# Altium project Tigershark 3D rev2 PreProduction Thermistors Version.PrjPcb (part 1 of 2)
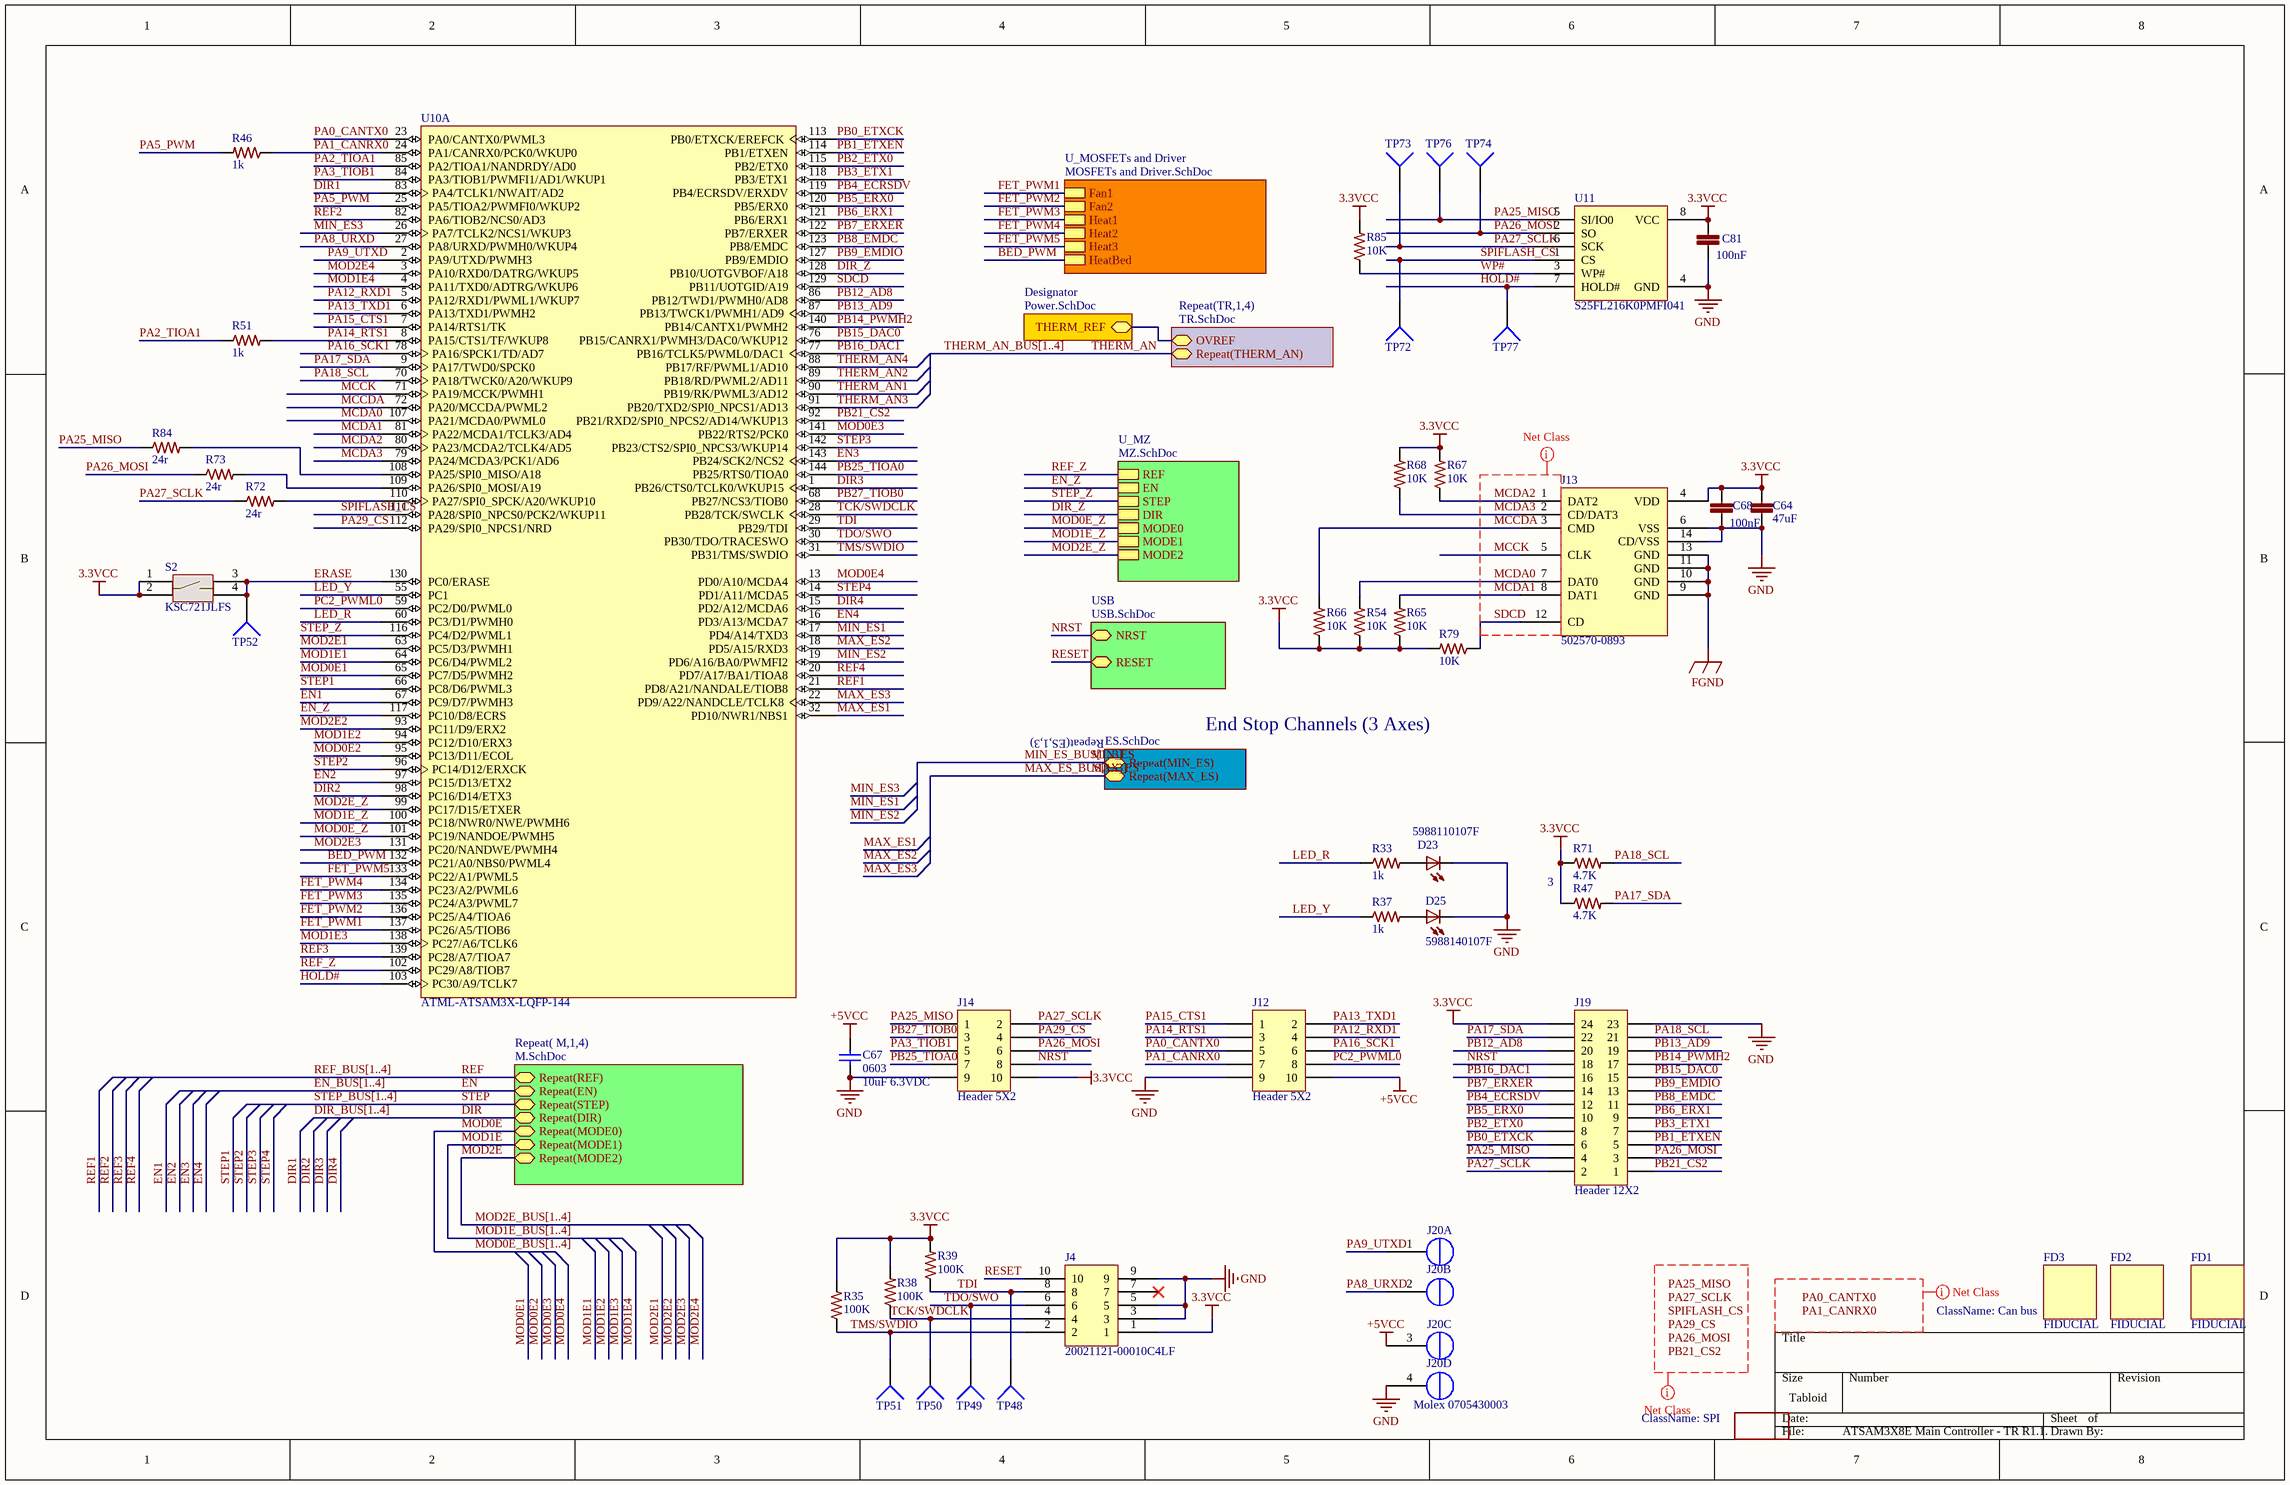
[diagram p0: ATSAM3X8E Main Controller - TR R1.1.SchDoc]
8 sheets, 511 parts. Net scope: hierarchical (ports join the sheet entries above them; power ports are global).
Board file: Tigershark 3D R2.4 - TR.PcbDoc
Sheets:
  ATSAM3X8E Main Controller - TR R1.1.SchDoc
    TR1 = TR.SchDoc
    TR2 = TR.SchDoc
    TR3 = TR.SchDoc
    TR4 = TR.SchDoc
    Designator = Power.SchDoc
    ES1 = ES.SchDoc
    ES2 = ES.SchDoc
    ES3 = ES.SchDoc
    M1 = M.SchDoc
    M2 = M.SchDoc
    M3 = M.SchDoc
    M4 = M.SchDoc
    U_MOSFETs and Driver = MOSFETs and Driver.SchDoc
    U_MZ = MZ.SchDoc
    USB = USB.SchDoc

## Sheet ATSAM3X8E Main Controller - TR R1.1.SchDoc
size Tabloid; DocumentNumber: 1; SheetNumber: 1; SheetTotal: 8

### Parts
C64  47uF  [C0805]
C67  0603  value 10uF 6.3VDC  [C0603]
C68  100nF  [C0402]
C81  100nF  [C0402]
D23  5988110107F  [LED2012120]
D25  5988140107F  [LED2012120]
FD1  FIDUCIAL  [FIDUCIAL-1X2]
FD2  FIDUCIAL  [FIDUCIAL-1X2]
FD3  FIDUCIAL  [FIDUCIAL-1X2]
J4  20021121-00010C4LF  [FTSH-105-XX-X-DV]
J12  Header 5X2  [HDR2X5]
J13  502570-0893  [502570-0893 - Molex SD]
J14  Header 5X2  [HDR2X5]
J19  Header 12X2  [HDR2X12]
J20  Molex 0705430003  [4POL254]  (parts A,B,C,D of 4)
LOGO1  OSHW_LOGO_8MILX0150-NT  [OSHW_8X150_NOTEXT]  (value not drawn)
R33  1k  [R0402]
R35  100K  [R0402]
R37  1k  [R0402]
R38  100K  [R0402]
R39  100K  [R0402]
R46  1k  [R0402]
R47  4.7K  [R0603]
R51  1k  [R0402]
R54  10K  [R0402]
R65  10K  [R0402]
R66  10K  [R0402]
R67  10K  [R0402]
R68  10K  [R0402]
R71  4.7K  [R0603]
R72  24r  [R0402]
R73  24r  [R0402]
R79  10K  [R0402]
R84  24r  [R0402]
R85  10K  [R0402]
S2  KSC721JLFS  [KSC721JLFS]
TP48  TP4  [TP-2]  (value not drawn)
TP49  TP4  [TP-2]  (value not drawn)
TP50  TP4  [TP-2]  (value not drawn)
TP51  TP4  [TP-2]  (value not drawn)
TP52  TP4  [TP-2]  (value not drawn)
TP72  TP4  [TP-2]  (value not drawn)
TP73  TP4  [TP-2]  (value not drawn)
TP74  TP4  [TP-2]  (value not drawn)
TP76  TP4  [TP-2]  (value not drawn)
TP77  TP4  [TP-2]  (value not drawn)
U10  ATML-ATSAM3X-LQFP-144  [LQFP144_N]  (part A of 3)
U11  S25FL216K0PMFI041  [S25FL216K0PMFI041]

### Sub-sheets
Designator = Power.SchDoc: THERM_REF
Repeat( M,1,4) = M.SchDoc: Repeat(REF), Repeat(EN), Repeat(STEP), Repeat(DIR), Repeat(MODE0), Repeat(MODE1), Repeat(MODE2)
Repeat(ES,1,3) = ES.SchDoc: Repeat(MAX_ES), Repeat(MIN_ES)
Repeat(TR,1,4) = TR.SchDoc: OVREF, Repeat(THERM_AN)
U_MOSFETs and Driver = MOSFETs and Driver.SchDoc: Fan1, Fan2, Heat1, Heat2, Heat3, HeatBed
U_MZ = MZ.SchDoc: REF, EN, STEP, DIR, MODE0, MODE1, MODE2
USB = USB.SchDoc: NRST, RESET

### Nets
3.3VCC: C64.1 C68.1 C81.1 J4.1 J13.4(VDD) J14.10 J19.24 R35.2 R38.2 R39.2 R47.1 R54.1 R65.1 R66.1 R67.2 R68.2 R71.1 R79.2 R85.2 S2.1 S2.2 U11.8(VCC)
+5VCC: C67.2 J12.10 J20.3(OUT1A)
FGND: J13.9(GND) J13.10(GND) J13.11(GND) J13.13(GND)
GND: C64.2 C67.1 C68.2 C81.2 D23.C D25.C J4.3 J4.5 J4.9 J12.9 J13.6(VSS) J13.14(CD/VSS) J14.9 J19.23 J20.4(OUT1B) U11.4(GND)
BED_PWM: U10.132(PC21/A0/NBS0/PWML4) ; sheet U_MOSFETs and Driver/HeatBed
DIR: sheet Repeat( M,1,4)/Repeat(DIR)
DIR1: U10.83(PA4/TCLK1/NWAIT/AD2)
DIR2: U10.98(PC16/D14/ETX3)
DIR3: U10.1(PB26/CTS0/TCLK0/WKUP15)
DIR4: U10.15(PD2/A12/MCDA6)
DIR_Z: U10.128(PB10/UOTGVBOF/A18) ; sheet U_MZ/DIR
EN: sheet Repeat( M,1,4)/Repeat(EN)
EN1: U10.67(PC9/D7/PWMH3)
EN2: U10.97(PC15/D13/ETX2)
EN3: U10.143(PB24/SCK2/NCS2)
EN4: U10.16(PD3/A13/MCDA7)
EN_Z: U10.117(PC10/D8/ECRS) ; sheet U_MZ/EN
ERASE: S2.3 S2.4 TP52.1 U10.130(PC0/ERASE)
FET_PWM1: U10.137(PC26/A5/TIOB6) ; sheet U_MOSFETs and Driver/Fan1
FET_PWM2: U10.136(PC25/A4/TIOA6) ; sheet U_MOSFETs and Driver/Fan2
FET_PWM3: U10.135(PC24/A3/PWML7) ; sheet U_MOSFETs and Driver/Heat1
FET_PWM4: U10.134(PC23/A2/PWML6) ; sheet U_MOSFETs and Driver/Heat2
FET_PWM5: U10.133(PC22/A1/PWML5) ; sheet U_MOSFETs and Driver/Heat3
HOLD#: TP77.1 U10.103(PC30/A9/TCLK7) U11.7(HOLD#)
LED_R: R33.1 U10.60(PC3/D1/PWMH0)
LED_Y: R37.1 U10.55(PC1)
MAX_ES: sheet Repeat(ES,1,3)/Repeat(MAX_ES)
MAX_ES1: U10.32(PD10/NWR1/NBS1)
MAX_ES2: U10.18(PD5/A15/RXD3)
MAX_ES3: U10.22(PD9/A22/NANDCLE/TCLK8)
MCCDA: J13.3(CMD) R66.2 U10.72(PA20/MCCDA/PWML2)
MCCK: J13.5(CLK) U10.71(PA19/MCCK/PWMH1)
MCDA0: J13.7(DAT0) R54.2 U10.107(PA21/MCDA0/PWML0)
MCDA1: J13.8(DAT1) R65.2 U10.81(PA22/MCDA1/TCLK3/AD4)
MCDA2: J13.1(DAT2) R67.1 U10.80(PA23/MCDA2/TCLK4/AD5)
MCDA3: J13.2(CD/DAT3) R68.1 U10.79(PA24/MCDA3/PCK1/AD6)
MIN_ES: sheet Repeat(ES,1,3)/Repeat(MIN_ES)
MIN_ES1: U10.17(PD4/A14/TXD3)
MIN_ES2: U10.19(PD6/A16/BA0/PWMFI2)
MIN_ES3: U10.26(PA7/TCLK2/NCS1/WKUP3)
MOD0E: sheet Repeat( M,1,4)/Repeat(MODE0)
MOD0E1: U10.65(PC7/D5/PWMH2)
MOD0E2: U10.95(PC13/D11/ECOL)
MOD0E3: U10.141(PB22/RTS2/PCK0)
MOD0E4: U10.13(PD0/A10/MCDA4)
MOD0E_Z: U10.101(PC19/NANDOE/PWMH5) ; sheet U_MZ/MODE0
MOD1E: sheet Repeat( M,1,4)/Repeat(MODE1)
MOD1E1: U10.64(PC6/D4/PWML2)
MOD1E2: U10.94(PC12/D10/ERX3)
MOD1E3: U10.138(PC27/A6/TCLK6)
MOD1E4: U10.4(PA11/TXD0/ADTRG/WKUP6)
MOD1E_Z: U10.100(PC18/NWR0/NWE/PWMH6) ; sheet U_MZ/MODE1
MOD2E: sheet Repeat( M,1,4)/Repeat(MODE2)
MOD2E1: U10.63(PC5/D3/PWMH1)
MOD2E2: U10.93(PC11/D9/ERX2)
MOD2E3: U10.131(PC20/NANDWE/PWMH4)
MOD2E4: U10.3(PA10/RXD0/DATRG/WKUP5)
MOD2E_Z: U10.99(PC17/D15/ETXER) ; sheet U_MZ/MODE2
NRST: J14.8 J19.18 ; sheet USB/NRST
PA0_CANTX0: J12.5 U10.23(PA0/CANTX0/PWML3)
PA1_CANRX0: J12.7 R46.1 U10.24(PA1/CANRX0/PCK0/WKUP0)
PA2_TIOA1: R51.1 U10.85(PA2/TIOA1/NANDRDY/AD0)
PA3_TIOB1: J14.5 U10.84(PA3/TIOB1/PWMFI1/AD1/WKUP1)
PA5_PWM: R46.2 U10.25(PA5/TIOA2/PWMFI0/WKUP2)
PA8_URXD: J20.2(OUT2A) U10.27(PA8/URXD/PWMH0/WKUP4)
PA9_UTXD: J20.1(OUT2B) U10.2(PA9/UTXD/PWMH3)
PA12_RXD1: J12.4 U10.5(PA12/RXD1/PWML1/WKUP7)
PA13_TXD1: J12.2 U10.6(PA13/TXD1/PWMH2)
PA14_RTS1: J12.3 R51.2 U10.8(PA15/CTS1/TF/WKUP8)
PA15_CTS1: J12.1 U10.7(PA14/RTS1/TK)
PA16_SCK1: J12.6 U10.78(PA16/SPCK1/TD/AD7)
PA17_SDA: J19.22 R47.2 U10.9(PA17/TWD0/SPCK0)
PA18_SCL: J19.21 R71.2 U10.70(PA18/TWCK0/A20/WKUP9)
PA25_MISO: J14.1 J19.4 R84.1 TP76.1 U11.5(SI/IO0)
PA26_MOSI: J14.6 J19.3 R73.1 TP74.1 U11.2(SO)
PA27_SCLK: J14.2 J19.2 R72.1 TP73.1 U11.6(SCK)
PA29_CS: J14.4 U10.112(PA29/SPI0_NPCS1/NRD)
PB0_ETXCK: J19.6 U10.113(PB0/ETXCK/EREFCK)
PB1_ETXEN: J19.5 U10.114(PB1/ETXEN)
PB2_ETX0: J19.8 U10.115(PB2/ETX0)
PB3_ETX1: J19.7 U10.118(PB3/ETX1)
PB4_ECRSDV: J19.12 U10.119(PB4/ECRSDV/ERXDV)
PB5_ERX0: J19.10 U10.120(PB5/ERX0)
PB6_ERX1: J19.9 U10.121(PB6/ERX1)
PB7_ERXER: J19.14 U10.122(PB7/ERXER)
PB8_EMDC: J19.11 U10.123(PB8/EMDC)
PB9_EMDIO: J19.13 U10.127(PB9/EMDIO)
PB12_AD8: J19.20 U10.86(PB12/TWD1/PWMH0/AD8)
PB13_AD9: J19.19 U10.87(PB13/TWCK1/PWMH1/AD9)
PB14_PWMH2: J19.17 U10.140(PB14/CANTX1/PWMH2)
PB15_DAC0: J19.15 U10.76(PB15/CANRX1/PWMH3/DAC0/WKUP12)
PB16_DAC1: J19.16 U10.77(PB16/TCLK5/PWML0/DAC1)
PB21_CS2: J19.1 U10.92(PB21/RXD2/SPI0_NPCS2/AD14/WKUP13)
PB25_TIOA0: J14.7 U10.144(PB25/RTS0/TIOA0)
PB27_TIOB0: J14.3 U10.68(PB27/NCS3/TIOB0)
PC2_PWML0: J12.8 U10.59(PC2/D0/PWML0)
REF: sheet Repeat( M,1,4)/Repeat(REF)
REF1: U10.21(PD8/A21/NANDALE/TIOB8)
REF2: U10.82(PA6/TIOB2/NCS0/AD3)
REF3: U10.139(PC28/A7/TIOA7)
REF4: U10.20(PD7/A17/BA1/TIOA8)
REF_Z: U10.102(PC29/A8/TIOB7) ; sheet U_MZ/REF
RESET: J4.10 ; sheet USB/RESET
SDCD: J13.12(CD) R79.1 U10.129(PB11/UOTGID/A19)
SPIFLASH_CS: TP72.1 U10.111(PA28/SPI0_NPCS0/PCK2/WKUP11) U11.1(CS)
STEP: sheet Repeat( M,1,4)/Repeat(STEP)
STEP1: U10.66(PC8/D6/PWML3)
STEP2: U10.96(PC14/D12/ERXCK)
STEP3: U10.142(PB23/CTS2/SPI0_NPCS3/WKUP14)
STEP4: U10.14(PD1/A11/MCDA5)
STEP_Z: U10.116(PC4/D2/PWML1) ; sheet U_MZ/STEP
TCK/SWDCLK: J4.4 R38.1 TP50.1 U10.28(PB28/TCK/SWCLK)
TDI: J4.8 R39.1 TP48.1 U10.29(PB29/TDI)
TDO/SWO: J4.6 TP49.1 U10.30(PB30/TDO/TRACESWO)
THERM_AN: sheet Repeat(TR,1,4)/Repeat(THERM_AN)
THERM_AN1: U10.90(PB19/RK/PWML3/AD12)
THERM_AN2: U10.89(PB18/RD/PWML2/AD11)
THERM_AN3: U10.91(PB20/TXD2/SPI0_NPCS1/AD13)
THERM_AN4: U10.88(PB17/RF/PWML1/AD10)
TMS/SWDIO: J4.2 R35.1 TP51.1 U10.31(PB31/TMS/SWDIO)
WP#: R85.1 U11.3(WP#)
NetD13A_C: sheet Repeat(TR,1,4)/OVREF, sheet Designator/THERM_REF
NetD23_A: D23.A R33.2
NetD25_A: D25.A R37.2
NetR72_2: R72.2 U10.110(PA27/SPI0_SPCK/A20/WKUP10)
NetR73_2: R73.2 U10.109(PA26/SPI0_MOSI/A19)
NetR84_2: R84.2 U10.108(PA25/SPI0_MISO/A18)

Not connected (* = marked no-connect by the designer): J4 7*

### Buses and harness runs
bus DIR_BUS[1..4]
bus EN_BUS[1..4]
bus MAX_ES_BUS[1..3]
bus MIN_ES_BUS[1..3]
bus MOD0E_BUS[1..4]
bus MOD1E_BUS[1..4]
bus MOD2E_BUS[1..4]
bus REF_BUS[1..4]
bus STEP_BUS[1..4]
bus THERM_AN_BUS[1..4]

### Layout directives
net class SD: MCCDA, MCCK, MCDA0, MCDA1, MCDA2, MCDA3, SDCD
net class Can bus: PA0_CANTX0, PA1_CANRX0
net class SPI: PA25_MISO, PA26_MOSI, PA27_SCLK, PA29_CS, PB21_CS2, SPIFLASH_CS

### Notes on the sheet
- End Stop Channels (3 Axes)
- 3
- Labels drawn without touching a wire or pin: PA0_CANTX0, PA1_CANRX0, PA25_MISO, PA26_MOSI, PA27_SCLK, PA29_CS, PB21_CS2, SPIFLASH_CS

### Library data of the parts
C64 = CL21A476MQCLRNC: CAP CER 47UF 6.3V 20% X5R 0805; Manufacturer: Samsung; LastRevisionNote: ImportComponents; Published: 10 - may 2015; Publisher: UltiMachine; LastRevisionDate: 10 may 2015; ManufacturerPartNumber: CL21A476MQCLRNC; VALUE: 47uF
C67 = C1608JB0J106K080AB: CAP CER 10UF 6.3V 10% JB 0603; MFR: TDK; Voltage: 6.3VDC; Published: 10 - Dec - 2014; LatestRevisionDate: 10 - Dec - 2014; Component Type: Chip Capacitor; MFR Part #: C1608JB0J106K080AB; Part Description: CAP CER 10UF 6.3V 10% JB 0603; Mounting Type: SMT 0603; Datasheet: http://www.tdk.com/pdf/TDKMLCCCapRange.pdf; Height: 0.9mm; Tolerance: 10%; Digikey #: 445-11185-1-ND; PackageReference: 0402
C68 C81 = GRM155R71C104KA88D: CAP CER 0402 100nF 16V 10% X7R; LastRevisionNote: ImportComponents; Published: 23-Apr-2014; Publisher: UltiMachine; LastRevisionDate: 23-Apr-2014; ManufacturerPartNumber: GRM155R71C104KA88D; VALUE: 100nF
D23 = 5988110107F: LED 0805 Red; LastRevisionNote: ImportComponents; Published: 23-Apr-2014; Publisher: UltiMachine; LastRevisionDate: 23-Apr-2014; VALUE: 5988110107F
D25 = 5988140107F: LED 0805 Yellow; LastRevisionNote: ImportComponents; Published: 23-Apr-2014; Publisher: UltiMachine; LastRevisionDate: 23-Apr-2014; VALUE: 5988140107F
J4 = ARM Cortex JTAG-DEBUG Header
J12 J14 = Header 5X2: Header, 5-Pin, Dual row; LatestRevisionDate: 17-Jul-2002; LatestRevisionNote: Re-released for DXP Platform.; Publisher: Altium Limited
J13 = 502570-0893: microSD 502570-0893 Molex Part
J19 = Header 12X2: Header, 12-Pin, Dual row; LatestRevisionDate: 17-Jul-2002; LatestRevisionNote: Re-released for DXP Platform.; Publisher: Altium Limited
J20 = Molex 0705430003 Alt: Molex 4 Pin Clip Connector
LOGO1 = OSHW_LOGO_8MILX0150-NT: LastRevisionNote: ImportComponents; Published: 23-Apr-2014; Publisher: UltiMachine; LastRevisionDate: 23-Apr-2014
R33 R37 R46 R51 = RK73H1ETTP1001F: RES 0402 1k 63mW 1%; LastRevisionNote: ImportComponents; Published: 23-Apr-2014; Publisher: UltiMachine; LastRevisionDate: 23-Apr-2014; VALUE: 1k
R35 R38 R39 = RC1005F104CS: RES SMD 100K OHM 1% 1/16W 0402; Manufacturer: Samsung; LastRevisionNote: ImportComponents; Digilkey #: 1276-3432-1-ND; Published: 23-Apr-2014; Publisher: UltiMachine; LastRevisionDate: 23-Apr-2014; ManufacturerPartNumber: RC1005F104CS; VALUE: 100K
R47 R71 = ERJ3EKF4701V: RES 0603 4.7K 100mW 1%; LastRevisionNote: ImportComponents; Published: 23-Apr-2014; Publisher: UltiMachine; LastRevisionDate: 23-Apr-2014; ManufacturerPartNumber: ERJ3EKF4701V; VALUE: 4.7K
R54 R65-R68 R79 R85 = RC0402FR-0710KP: RES SMD 10K OHM 1% 1/16W 0402; LastRevisionNote: ImportComponents; Published: 23-Apr-2014; Publisher: UltiMachine; LastRevisionDate: 23-Apr-2014; ManufacturerPartNumber: RC0402FR-0710KP; VALUE: 10K
R72 R73 R84 = CRCW040224R0FKED: Res Thick Film 0402 24 Ohm 1% 0.063W; ManufacturerPartNumber: CRCW0402200KFKED; LastRevisionNote: ImportComponents; Published: 23-Apr-2014; Publisher: UltiMachine; LastRevisionDate: 23-Apr-2014; VALUE: 24r
S2 = KSC721JLFS: Switch SPST 1.7 N / 1.8 N J Bend Surface Mount Tactile Switch
TP48-TP52 TP72-TP74 TP76 TP77 = Socket: LatestRevisionDate: 17-Jul-2002; LatestRevisionNote: Re-released for DXP Platform.; Publisher: Altium Limited
U11 = S25FL216K0PMFI041: Manufacture: Spansion; Active: Yes; Manufacture Part #: S25FL216K0PMFI041; Mounting Type: SMD; Type: SOIC; Datasheet: http://www.spansion.com/Support/Datasheets/S25FL216K_00.pdf; Digikey Part NUmber: 1274-1052-ND; Price: $0.35

## Sheet TR.SchDoc
size Letter; DocumentNumber: 6; SheetNumber: 6; SheetTotal: 8
Used 4 times, as channels TR1, TR2, TR3, TR4. Parts and nets are listed once, with the designators drawn on the sheet.
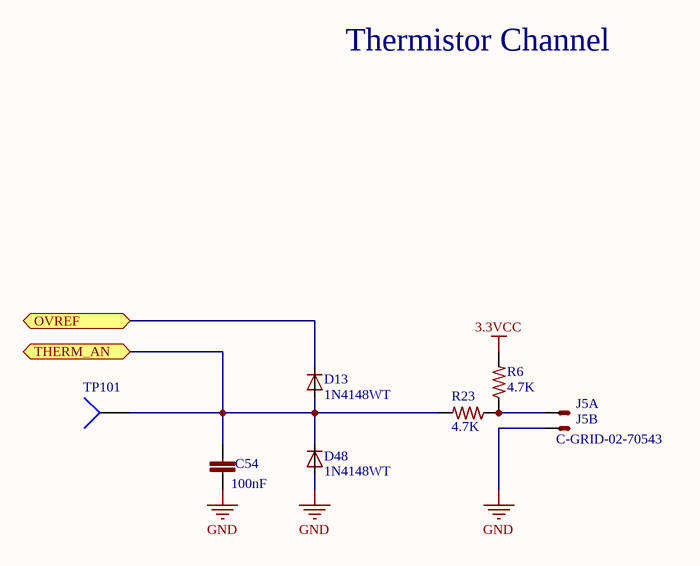
[diagram p1: TR.SchDoc]

### Parts
C54  100nF  [C0402]
D13  1N4148WT  [SOD523]
D48  1N4148WT  [SOD523]
J5  C-GRID-02-70543  [70543-02]  (value not drawn)  (parts A,B of 2)
R6  4.7K  [R0603]
R23  4.7K  [R0603]
TP101  TP4  [TP-2]  (value not drawn)

### Ports
OVREF, THERM_AN

### Nets
3.3VCC: R6.2
GND: C54.2 D48.A J5.2(S)
OVREF: D13.C ; port OVREF
THERM_AN: C54.1 D13.A D48.C R23.2 TP101.1 ; port THERM_AN
NetJ5_1: J5.1(S) R6.1 R23.1

### Channels
TR1: designators C54=C54A D13=D13A D48=D48A J5=J5A R6=R6A R23=R23A#1 TP101=TP101A; ports OVREF=NetD13A_C THERM_AN=THERM_AN1
TR2: designators C54=C54B D13=D13B D48=D48B J5=J5B R6=R6B R23=R23B#1 TP101=TP101B; ports OVREF=NetD13A_C THERM_AN=THERM_AN2
TR3: designators C54=C54C D13=D13C D48=D48C J5=J5C R6=R6C R23=R23C#1 TP101=TP101C; ports OVREF=NetD13A_C THERM_AN=THERM_AN3
TR4: designators end in D; ports OVREF=NetD13A_C THERM_AN=THERM_AN4

### Notes on the sheet
- Thermistor Channel

### Library data of the parts
C54 = GRM155R71C104KA88D: as C68 on sheet ATSAM3X8E Main Controller - TR R1.1; Published: 23-Apr-2014; Publisher: UltiMachine; LastRevisionDate: 23-Apr-2014; ManufacturerPartNumber: GRM155R71C104KA88D; VALUE: 100nF
D13 D48 = 1N4148WT: DIODE SOD523; LastRevisionNote: ImportComponents; Published: 23-Apr-2014; Publisher: UltiMachine; LastRevisionDate: 23-Apr-2014; Value: 1N4148WT
J5 = C-GRID-02-70543: Connector 2pos; LastRevisionNote: ImportComponents; Published: 23-Apr-2014; Publisher: UltiMachine; LastRevisionDate: 23-Apr-2014
R6 R23 = ERJ3EKF4701V: as R47 on sheet ATSAM3X8E Main Controller - TR R1.1; Published: 23-Apr-2014; Publisher: UltiMachine; LastRevisionDate: 23-Apr-2014; ManufacturerPartNumber: ERJ3EKF4701V; VALUE: 4.7K
TP101 = Socket: LatestRevisionDate: 17-Jul-2002; LatestRevisionNote: Re-released for DXP Platform.; Publisher: Altium Limited

## Sheet Power.SchDoc
size Letter; DocumentNumber: 8; SheetNumber: 8; SheetTotal: 8
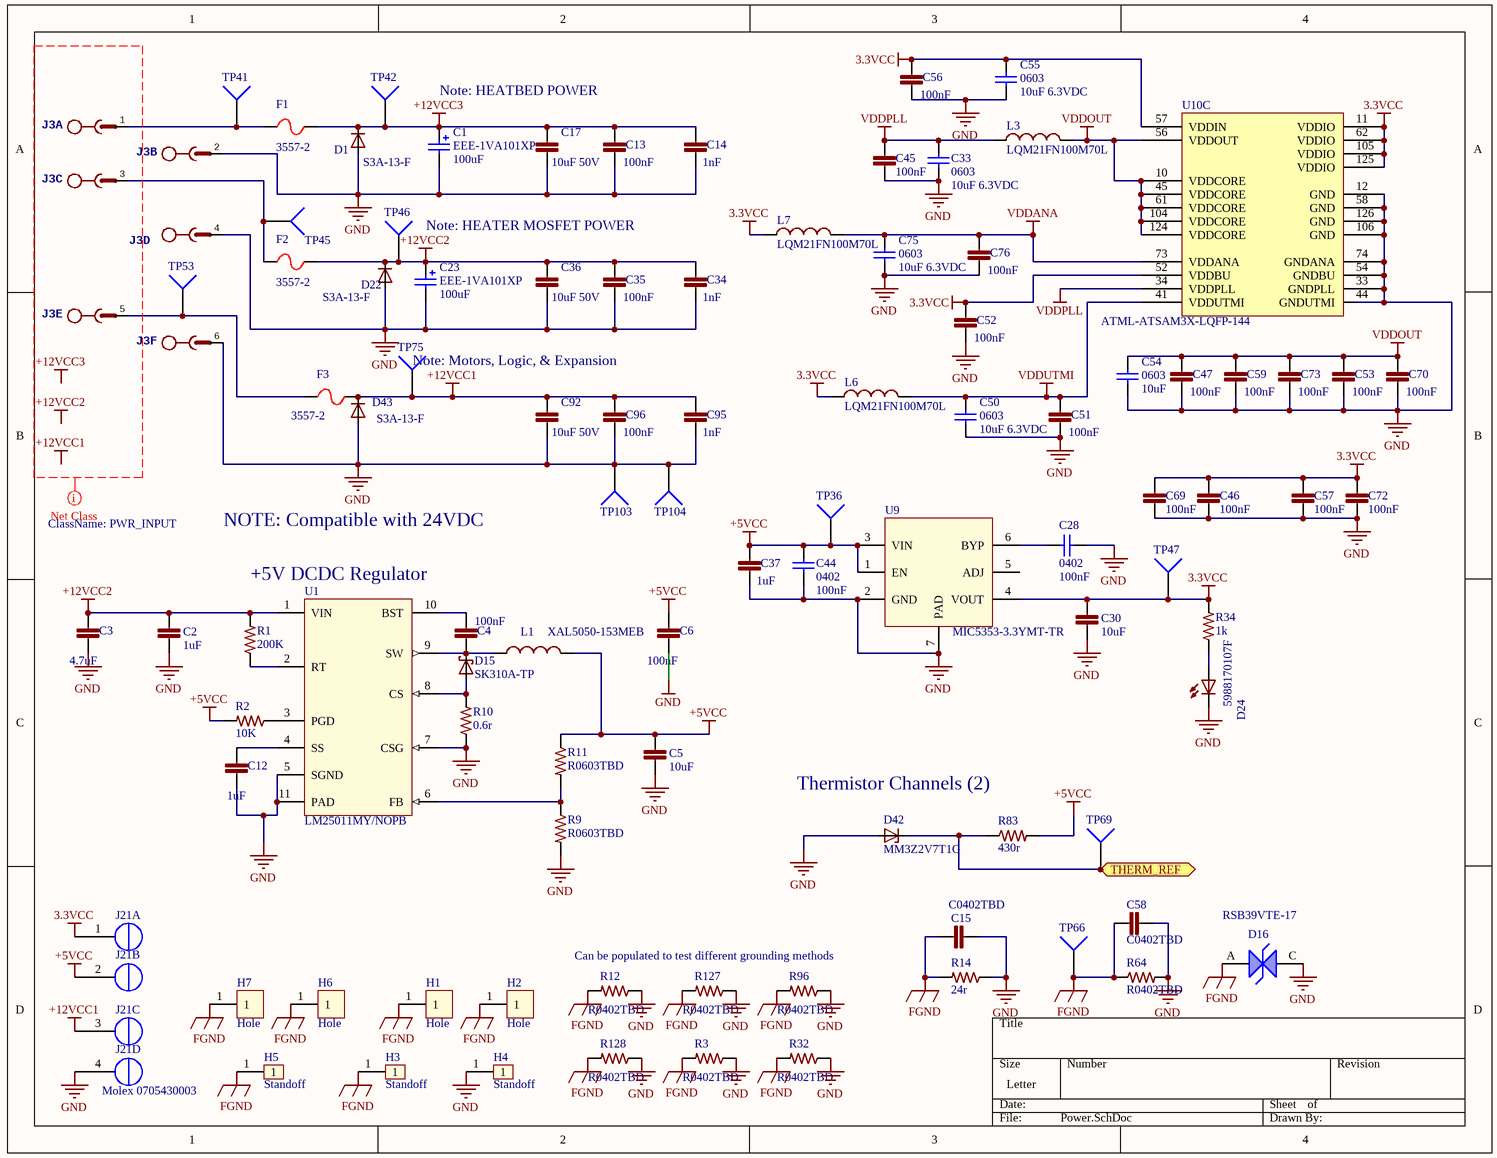
[diagram p2: Power.SchDoc]

### Parts
C1  EEE-1VA101XP  value 100uF  [EEE-1VA101XP]
C2  1uF  [C0805]
C3  4.7uF  [C1206]
C4  100nF  [C0603]
C5  10uF  [C0805]
C6  100nF  [C0402]
C12  1uF  [C0402]
C13  100nF  [C0603]
C14  1nF  [C0603]
C15  C0402TBD  [C0402]
C17  10uF 50V  [C1206]
C23  EEE-1VA101XP  value 100uF  [EEE-1VA101XP]
C28  value 100nF  [C0402]  (hidden comment: 0402)
C30  10uF  [C0805]
C33  0603  value 10uF 6.3VDC  [C0603]
C34  1nF  [C0603]
C35  100nF  [C0603]
C36  10uF 50V  [C1206]
C37  1uF  [C0402]
C44  value 100nF  [C0402]  (hidden comment: 0402)
C45  100nF  [C0402]
C46  100nF  [C0402]
C47  100nF  [C0402]
C50  0603  value 10uF 6.3VDC  [C0603]
C51  100nF  [C0402]
C52  100nF  [C0402]
C53  100nF  [C0402]
C54  0603  value 10uF  [C0603]
C55  0603  value 10uF 6.3VDC  [C0603]
C56  100nF  [C0402]
C57  100nF  [C0402]
C58  C0402TBD  [C0402]
C59  100nF  [C0402]
C69  100nF  [C0402]
C70  100nF  [C0402]
C72  100nF  [C0402]
C73  100nF  [C0402]
C75  0603  value 10uF 6.3VDC  [C0603]
C76  100nF  [C0402]
C92  10uF 50V  [C1206]
C95  1nF  [C0603]
C96  100nF  [C0603]
D1  S3A-13-F  [DO-214AB]
D15  SK310A-TP  [SMA-SM]
D16  RSB39VTE-17  [SOD323-R]
D22  S3A-13-F  [DO-214AB]
D24  5988170107F  [LED2012120]
D42  MM3Z2V7T1G  [SOD323-R]
D43  S3A-13-F  [DO-214AB]
F1  3557-2  [3557]
F2  3557-2  [3557]
F3  3557-2  [3557]
H1  Hole  [Wave_hole_3x7-singleSided]  (no BOM)
H2  Hole  [Wave_hole_3x7-singleSided]  (no BOM)
H3  Standoff  [Standoff3mmTopConn]  (no BOM)
H4  Standoff  [Standoff3mmTopConn]  (no BOM)
H5  Standoff  [Standoff3mmTopConn]  (no BOM)
H6  Hole  [Wave_hole_3x7-singleSided]  (no BOM)
H7  Hole  [Wave_hole_3x7-singleSided]  (no BOM)
J3  MSTBV6  [MSTBV6]  (value not drawn)  (parts A,B,C,D,E,F of 6)
J21  Molex 0705430003  [4POL254]  (parts A,B,C,D of 4)
L1  XAL5050-153MEB  [XAL50xx-153]
L3  LQM21FN100M70L  [C0805]
L6  LQM21FN100M70L  [C0805]
L7  LQM21FN100M70L  [C0805]
R1  200K  [R0402]
R2  10K  [R0402]
R3  R0402TBD  [R0402]
R9  R0603TBD  [R0603]
R10  0.6r  [2512R-0.55]
R11  R0603TBD  [R0603]
R12  R0402TBD  [R0402]
R14  24r  [R0402]
R32  R0402TBD  [R0402]
R34  1k  [R0402]
R64  R0402TBD  [R0402]
R83  430r  [R0603]
R96  R0402TBD  [R0402]
R127  R0402TBD  [R0402]
R128  R0402TBD  [R0402]
TP36  TP4  [TP-2]  (value not drawn)
TP41  TP4  [TP-2]  (value not drawn)
TP42  TP4  [TP-2]  (value not drawn)
TP45  TP4  [TP-2]  (value not drawn)
TP46  TP4  [TP-2]  (value not drawn)
TP47  TP4  [TP-2]  (value not drawn)
TP53  TP4  [TP-2]  (value not drawn)
TP66  TP4  [TP-2]  (value not drawn)
TP69  TP4  [TP-2]  (value not drawn)
TP75  TP4  [TP-2]  (value not drawn)
TP103  TP4  [TP-2]  (value not drawn)
TP104  TP4  [TP-2]  (value not drawn)
U1  LM25011MY/NOPB  [VSSOP10]
U9  MIC5353-3.3YMT-TR  [TDFN1616-6LD-PL-1]
U10  ATML-ATSAM3X-LQFP-144  [LQFP144_N]  (part C of 3)

### Ports
THERM_REF

### Nets
3.3VCC: C30.1 C46.1 C52.1 C55.2 C56.1 C57.1 C69.1 C72.1 J21.1(OUT2B) L6.1 L7.1 R34.2 TP47.1 U9.4(VOUT) U10.11(VDDIO) U10.52(VDDBU) U10.57(VDDIN) U10.62(VDDIO) U10.105(VDDIO) U10.125(VDDIO)
+5VCC: C5.1 C6.2 C37.1 C44.1 J21.2(OUT2A) L1.2 R2.2 R11.1 R83.2 TP36.1 U9.1(EN) U9.3(VIN)
+12VCC1: C92.1 C95.1 C96.1 D43.C F3.2 J21.3(OUT1A) TP75.1
+12VCC2: C2.1 C3.1 C23.1 C34.1 C35.1 C36.1 D22.C F2.2 R1.2 TP46.1 U1.1(VIN)
+12VCC3: C1.1 C13.1 C14.1 C17.1 D1.C F1.2 TP42.1
FGND: C15.1 C58.1 D16.A H1.1 H2.1 H3.1 H5.1 H6.1 H7.1 R3.2 R12.2 R14.2 R32.2 R64.1 R96.2 R127.2 R128.2 TP66.1
GND: C1.2 C2.2 C3.2 C5.2 C6.1 C12.2 C13.2 C14.2 C15.2 C17.2 C23.2 C28.2 C30.2 C33.1 C34.2 C35.2 C36.2 C37.2 C44.2 C45.2 C46.2 C47.2 C50.1 C51.2 C52.2 C53.2 C54.1 C55.1 C56.2 C57.2 C58.2 C59.2 C69.2 C70.2 C72.2 C73.2 C75.1 C76.2 C92.2 C95.2 C96.2 D1.A D16.C D22.A D24.C D42.A D43.A H4.1 J3.2 J3.4 J3.6 J21.4(OUT1B) R3.1 R9.2 R10.1 R12.1 R14.1 R32.1 R64.2 R96.1 R127.1 R128.1 TP103.1 TP104.1 U1.5(SGND) U1.7(CSG) U1.11(PAD) U9.2(GND) U9.7(PAD) U10.12(GND) U10.33(GNDPLL) U10.44(GNDUTMI) U10.54(GNDBU) U10.58(GND) U10.74(GNDANA) U10.106(GND) U10.126(GND)
VDDANA: C75.2 C76.1 L7.2 U10.73(VDDANA)
VDDOUT: C47.1 C53.1 C54.2 C59.1 C70.1 C73.1 L3.1 U10.10(VDDCORE) U10.45(VDDCORE) U10.56(VDDOUT) U10.61(VDDCORE) U10.104(VDDCORE) U10.124(VDDCORE)
VDDPLL: C33.2 C45.1 L3.2 U10.34(VDDPLL)
VDDUTMI: C50.2 C51.1 L6.2 U10.41(VDDUTMI)
NetC4_1: C4.1 U1.10(BST)
NetC4_2: C4.2 D15.C L1.1 U1.9(SW)
NetC12_1: C12.1 U1.4(SS)
NetC28_1: C28.1 U9.6(BYP)
NetD13A_C: D42.C R83.1 TP69.1 ; port THERM_REF
NetD15_A: D15.A R10.2 U1.8(CS)
NetD24_A: D24.A R34.1
NetF1_1: F1.1 J3.1 TP41.1
NetF2_1: F2.1 J3.3 TP45.1
NetF3_1: F3.1 J3.5 TP53.1
NetR1_1: R1.1 U1.2(RT)
NetR2_1: R2.1 U1.3(PGD)
NetR9_1: R9.1 R11.2 U1.6(FB)

Not connected (* = marked no-connect by the designer): U9 5(ADJ)

### Layout directives
net class PWR_INPUT: +12VCC1, +12VCC2, +12VCC3

### Notes on the sheet
- Note: HEATBED POWER
- Note: HEATER MOSFET POWER
- (near TP75) Note: Motors, Logic, & Expansion
- NOTE: Compatible with 24VDC
- +5V DCDC Regulator
- Thermistor Channels (2)
- Can be populated to test different grounding methods
- Labels drawn without touching a wire or pin: +12VCC1, +12VCC2, +12VCC3

### Library data of the parts
C1 C23 = EEE-1VA101XP: CAP ALUM 100UF 35V 20% SMD; Manufacture: Panasonic; Digikey Part #: PCE3951CT-ND; Price: $0.63; Mount Type: SMT Panasonic VS D Series; Status: Active; Height: 7.70mm; Datasheet: http://industrial.panasonic.com/www-cgi/jvcr13pz.cgi?E+PZ+3+ABA0002+EEE1VA101XP+7+WW; Manufacture Part #: EEE-1VA101XP
C2 = GRM21BR71H105KA12L: CAP CER 0805 1uF 50V 10% X7R; LastRevisionNote: ImportComponents; Published: 23-Apr-2014; Publisher: UltiMachine; LastRevisionDate: 23-Apr-2014; ManufacturerPartNumber: GRM21BR71H105KA12L; VALUE: 1uF
C3 = C1206C475K5PACTU: CAP CER 1206 4.7uF 50V 10% X5R; LastRevisionNote: ImportComponents; Published: 23-Apr-2014; Publisher: UltiMachine; LastRevisionDate: 23-Apr-2014; ManufacturerPartNumber: C1206C475K5PACTU; VALUE: 4.7uF
C4 C13 C35 C96 = C0603C104K5RACTU: CAP CER 0603 100nF 50V 10% X7R; LastRevisionNote: ImportComponents; Published: 23-Apr-2014; Publisher: UltiMachine; LastRevisionDate: 23-Apr-2014; ManufacturerPartNumber: C0603C104K5RACTU; VALUE: 100nF
C5 C30 = C0805C106K8PACTU: CAP CER 0805 10uF 10V 10% X5R; LastRevisionNote: ImportComponents; Published: 23-Apr-2014; Publisher: UltiMachine; LastRevisionDate: 23-Apr-2014; ManufacturerPartNumber: C0805C106K8PACTU; VALUE: 10uF
C6 C45-C47 C51-C53 C56 C57 C59 C69 C70 C72 C73 C76 = GRM155R71C104KA88D: as C68 on sheet ATSAM3X8E Main Controller - TR R1.1; Published: 23-Apr-2014; Publisher: UltiMachine; VALUE: 100nF; LastRevisionDate: 23-Apr-2014; ManufacturerPartNumber: GRM155R71C104KA88D
C12 C37 = GRM155R60J105KE19D: CAP CER 0402 1uF 6.3V 10% X5R; LastRevisionNote: ImportComponents; Published: 23-Apr-2014; Publisher: UltiMachine; LastRevisionDate: 23-Apr-2014; ManufacturerPartNumber: GRM155R60J105KE19D; VALUE: 1uF
C14 C34 C95 = C0603C102K5RACTU: CAP CER 0603  1nF 50v 10% X7R; LastRevisionNote: ImportComponents; Published: 23-Apr-2014; Publisher: UltiMachine; VALUE: 1nF; LastRevisionDate: 23-Apr-2014; ManufacturerPartNumber: C0603C102K5RACTU
C15 C58 = C0402TBD: Capacitor Non Polarized; LastRevisionNote: ImportComponents; Published: 23-Apr-2014; Publisher: UltiMachine; VALUE: C0402TBD; LastRevisionDate: 23-Apr-2014
C17 C36 C92 = CL31A106KBHNNNE: CAP CER 10UF 50V 10% X5R 1206; Manufacturer: Samsung; LastRevisionNote: ImportComponents; Published: 25-mar-2015; Publisher: UltiMachine; LastRevisionDate: 25-mar-2015; ManufacturerPartNumber: CL31A106KBHNNNE; VALUE: 10uF 50V
C28 C44 = 100nF C0402 - GRM155R71C104KA88D: Capacitor (Semiconductor SIM Model); MFR: Murata; Part Description: CAP CER 0.1UF 16V 10% X7R 0402; Tolerance: 10%; Voltage: 16v; Published: 10 - Dec - 2014; LatestRevisionDate: 10 - Dec - 2014; LatestRevisionNote: Ultimachine Footprint Added; Publisher: Ultimachine; Component Type: Chip Capacitor; MFR Part #: GRM155R71C104KA88D; Mounting Type: SMT 0402; Datasheet: http://psearch.murata.com/capacitor/product/GRM155R71C104KA88%23.pdf; Height: 0.5 ±0.05mm; PackageReference: 0402
C33 C50 C54 C55 C75 = C1608JB0J106K080AB: as C67 on sheet ATSAM3X8E Main Controller - TR R1.1; Published: 10 - Dec - 2014; LatestRevisionDate: 10 - Dec - 2014; Component Type: Chip Capacitor; MFR Part #: C1608JB0J106K080AB; Part Description: CAP CER 10UF 6.3V 10% JB 0603; Mounting Type: SMT 0603; Datasheet: http://www.tdk.com/pdf/TDKMLCCCapRange.pdf; Height: 0.9mm; Tolerance: 10%; Digikey #: 445-11185-1-ND; PackageReference: 0402
D1 D22 D43 = S3A-13-F: DIODE DO-214AB; LastRevisionNote: ImportComponents; Published: 23-Apr-2014; Publisher: UltiMachine; LastRevisionDate: 23-Apr-2014; Value: S3A-13-F
D15 = SK310A: DIODE Schottky 3A SMA; LastRevisionNote: ImportComponents; LastRevisionDate: 23-Apr-2014; ManufacturerPartNumber: SK310A; Published: 23-Apr-2014; Publisher: UltiMachine
D16 = RSB39VTE-17: DIODE TVS
D24 = 5988170107F: LED 0805 Green; LastRevisionNote: ImportComponents; Published: 23-Apr-2014; Publisher: UltiMachine; LastRevisionDate: 23-Apr-2014; VALUE: 5988170107F
D42 = MM3Z2V7T1G: Z-Diode 2.7V 10mA 200mW; LastRevisionNote: ImportComponents; Published: 23-Apr-2014; Publisher: UltiMachine; LastRevisionDate: 23-Apr-2014
F1-F3 = 3557-2: FUSE PTH ATO; LastRevisionNote: ImportComponents; Published: 23-Apr-2014; Publisher: UltiMachine; LastRevisionDate: 23-Apr-2014; ManufacturerPartNumber: 3557-2
H3-H5 = Standoff3TopConn: Mechanical - Top connect
J3 = MSTBV6: PHOENIX; LastRevisionNote: ImportComponents; Published: 23-Apr-2014; Publisher: UltiMachine; LastRevisionDate: 23-Apr-2014
J21 = Molex 0705430003 Alt: Molex 4 Pin Clip Connector
L1 = XAL5050-153MEB: IND 15uH 3.9A 20%; LastRevisionNote: ImportComponents; Published: 23-Apr-2014; Publisher: UltiMachine; LastRevisionDate: 23-Apr-2014; ManufacturerPartNumber: XAL5050-153MEB; Value: XAL5050-153MEB
L3 L6 L7 = LQM21FN100M70L: IND 0805 10uH 100mA 780 mOhm 20%; ManufacturerPartNumber: CBC2012T100M; LastRevisionNote: ImportComponents; Published: 23-Apr-2014; Publisher: UltiMachine; LastRevisionDate: 23-Apr-2014; Value: LQM21FN100M70L
R1 = CRCW0402200KFKED: RES 0402 200k 63mW 1%; LastRevisionNote: ImportComponents; Published: 23-Apr-2014; Publisher: UltiMachine; LastRevisionDate: 23-Apr-2014; ManufacturerPartNumber: CRCW0402200KFKED; VALUE: 200K
R2 = RC0402FR-0710KP: as R54 on sheet ATSAM3X8E Main Controller - TR R1.1; Published: 23-Apr-2014; Publisher: UltiMachine; LastRevisionDate: 23-Apr-2014; ManufacturerPartNumber: RC0402FR-0710KP; VALUE: 10K
R3 R12 R32 R64 R96 R127 R128 = R0402TBD: Resistor; LastRevisionNote: ImportComponents; Published: 23-Apr-2014; Publisher: UltiMachine; LastRevisionDate: 23-Apr-2014; VALUE: R0402TBD
R9 R11 = R0603TBD: Resistor; LastRevisionNote: ImportComponents; Published: 23-Apr-2014; Publisher: UltiMachine; LastRevisionDate: 23-Apr-2014; VALUE: R0603TBD
R10 = RL2512FK-070R06L: RES 0.06 OHM 1W 1% 2512 SMD; LastRevisionNote: ImportComponents; Published: 23-Apr-2014; Publisher: UltiMachine; LastRevisionDate: 23-Apr-2014; ManufacturerPartNumber: RL2512FK-070R06L; VALUE: 0.6r
R14 = CRCW040224R0FKED: as R72 on sheet ATSAM3X8E Main Controller - TR R1.1; Published: 23-Apr-2014; Publisher: UltiMachine; LastRevisionDate: 23-Apr-2014; VALUE: 24r
R34 = RK73H1ETTP1001F: as R33 on sheet ATSAM3X8E Main Controller - TR R1.1; Published: 23-Apr-2014; Publisher: UltiMachine; LastRevisionDate: 23-Apr-2014; VALUE: 1k
R83 = RC0603JR-07430RL: RES 0603 0.1 W 430 Ohms 5% ±100 ppm/°C SMT; LastRevisionNote: ImportComponents; Published: 23-Apr-2014; Publisher: UltiMachine; LastRevisionDate: 23-Apr-2014; ManufacturerPartNumber: RC0603JR-07430RL; VALUE: 430r
TP36 TP41 TP42 TP45-TP47 TP53 TP66 TP69 TP75 TP103 TP104 = Socket: LatestRevisionDate: 17-Jul-2002; LatestRevisionNote: Re-released for DXP Platform.; Publisher: Altium Limited
U1 = LM25011: REG BUCK; Value: LM25011MY/NOPB
U9 = MIC5353-3.3YMT-TR: LDO 3.3V 500mA - low ESR Cout

## Sheet ES.SchDoc
size Letter; DocumentNumber: 7; SheetNumber: 7; SheetTotal: 8
Used 3 times, as channels ES1, ES2, ES3. Parts and nets are listed once, with the designators drawn on the sheet.
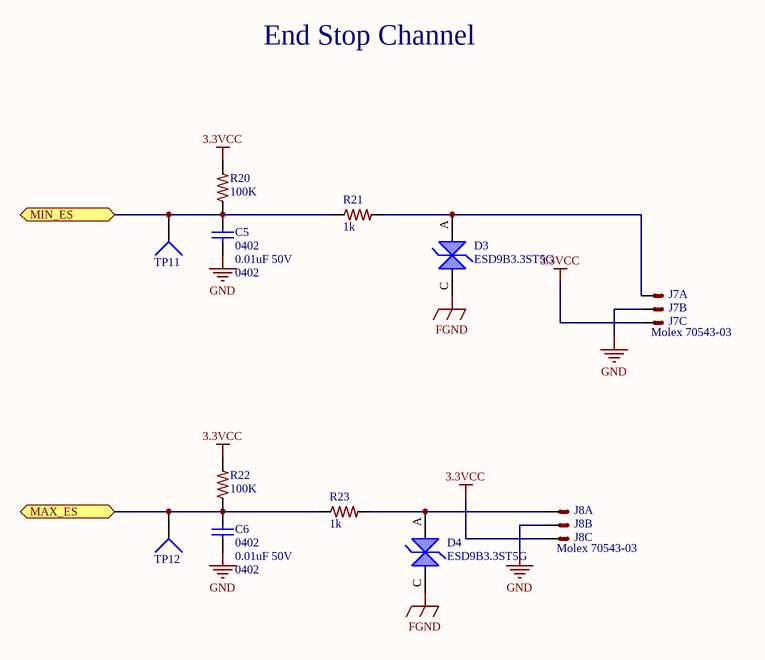
[diagram p3: ES.SchDoc]

### Parts
C5  0402  value 0.01uF 50V  [C0402]
C6  0402  value 0.01uF 50V  [C0402]
D3  ESD9B3.3ST5G  [SOD923-100X40-2N]
D4  ESD9B3.3ST5G  [SOD923-100X40-2N]
J7  Molex 70543-03  [70543-03]  (value not drawn)  (parts A,B,C of 3)
J8  Molex 70543-03  [70543-03]  (value not drawn)  (parts A,B,C of 3)
R20  100K  [R0402]
R21  1k  [R0402]
R22  100K  [R0402]
R23  1k  [R0402]
TP11  TP4  [TP-2]  (value not drawn)
TP12  TP4  [TP-2]  (value not drawn)

### Ports
MAX_ES, MIN_ES

### Nets
3.3VCC: J7.3(S) J8.3(S) R20.2 R22.2
FGND: D3.C D4.C
GND: C5.2 C6.2 J7.2(S) J8.2(S)
MAX_ES: C6.1 R22.1 R23.1 TP12.1 ; port MAX_ES
MIN_ES: C5.1 R20.1 R21.1 TP11.1 ; port MIN_ES
NetD3_A: D3.A J7.1(S) R21.2
NetD4_A: D4.A J8.1(S) R23.2

### Channels
ES1: designators C5=C5A C6=C6A D3=D3A D4=D4A J7=J7A J8=J8A R20=R20A R21=R21A R22=R22A R23=R23A#2 TP11=TP11A TP12=TP12A; ports MAX_ES=MAX_ES1 MIN_ES=MIN_ES1
ES2: designators C5=C5B C6=C6B D3=D3B D4=D4B J7=J7B J8=J8B R20=R20B R21=R21B R22=R22B R23=R23B#2 TP11=TP11B TP12=TP12B; ports MAX_ES=MAX_ES2 MIN_ES=MIN_ES2
ES3: designators C5=C5C C6=C6C D3=D3C D4=D4C J7=J7C J8=J8C R20=R20C R21=R21C R22=R22C R23=R23C#2 TP11=TP11C TP12=TP12C; ports MAX_ES=MAX_ES3 MIN_ES=MIN_ES3

### Notes on the sheet
- End Stop Channel

### Library data of the parts
C5 C6 = GRM155R71H103JA88D: CAP CER 10nF 50V X7R 0402; MFR: Murata; Part Description: CAP CER 10000PF 50V X7R 0402; Tolerance: 10%; Voltage: 6.3VDC; Published: 10 - Dec - 2014; Publisher: Ultimachine; LatestRevisionDate: 10 - Dec - 2014; LatestRevisionNote: Ultimachine Footprint Added; Component Type: Chip Capacitor; MFR Part #: GRM155R71H103JA88D; Mounting Type: SMT 0402; Datasheet: http://search.murata.co.jp/Ceramy/image/img/A01X/G101/ENG/GRM155R71H103JA88-01.pdf; Height: 0.5 ±0.05mm; Digikey #: 490-7763-1-ND; PackageReference: 0402
D3 D4 = ESD9B3.3ST5G: 11.5 V 15 pF SMT Transient Voltage Suppressor - SOD-923
J7 J8 = C-GRID-03-70543: Connector 2pos 2.54mm locking; LastRevisionNote: ImportComponents; Published: 23-Apr-2014; Publisher: UltiMachine; LastRevisionDate: 23-Apr-2014
R20 R22 = RC1005F104CS: as R35 on sheet ATSAM3X8E Main Controller - TR R1.1; Published: 23-Apr-2014; Publisher: UltiMachine; LastRevisionDate: 23-Apr-2014; ManufacturerPartNumber: RC1005F104CS; VALUE: 100K
R21 R23 = RK73H1ETTP1001F: as R33 on sheet ATSAM3X8E Main Controller - TR R1.1; Published: 23-Apr-2014; Publisher: UltiMachine; LastRevisionDate: 23-Apr-2014; VALUE: 1k
TP11 TP12 = Socket: LatestRevisionDate: 17-Jul-2002; LatestRevisionNote: Re-released for DXP Platform.; Publisher: Altium Limited

## Sheet M.SchDoc
size Letter; DocumentNumber: 3; SheetNumber: 3; SheetTotal: 8
Used 4 times, as channels M1, M2, M3, M4. Parts and nets are listed once, with the designators drawn on the sheet.
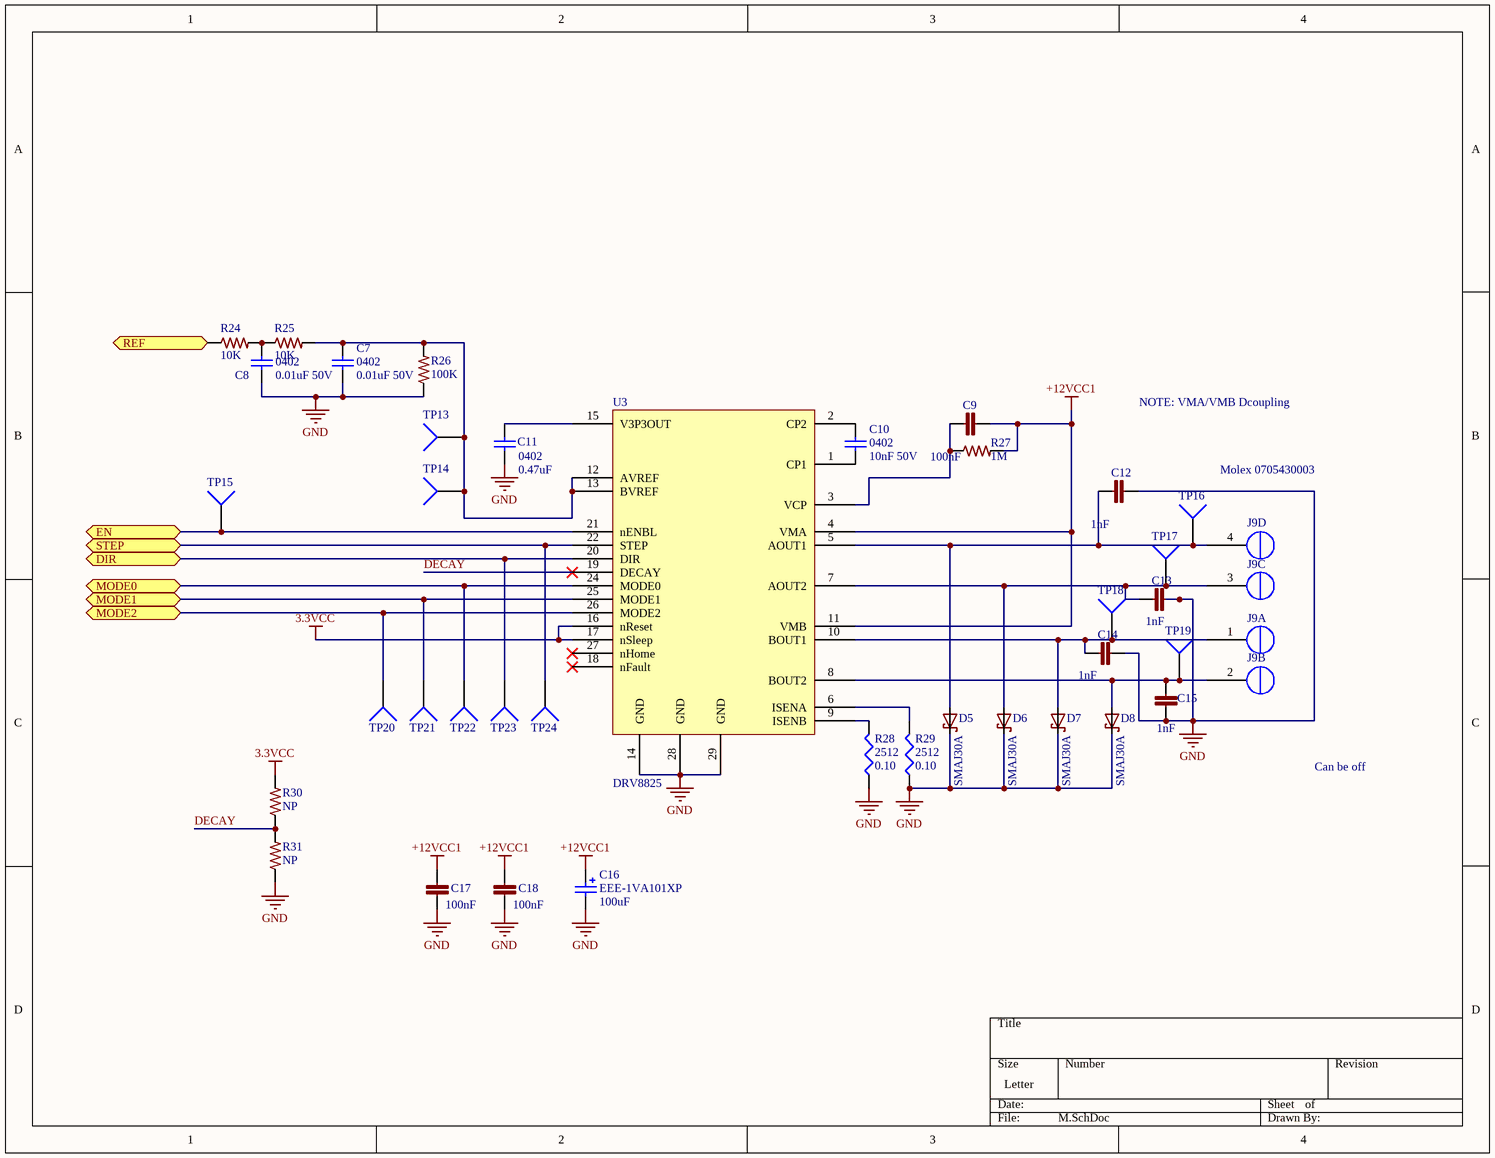
[diagram p4: M.SchDoc]

### Parts
C7  value 0.01uF 50V  [C0402]  (hidden comment: 0402)
C8  value 0.01uF 50V  [C0402]  (hidden comment: 0402)
C9  100nF  [C0402]
C10  value 10nF 50V  [C0402]  (hidden comment: 0402)
C11  value 0.47uF  [C0402]  (hidden comment: 0402)
C12  1nF  [C0603]
C13  1nF  [C0603]
C14  1nF  [C0603]
C15  1nF  [C0603]
C16  EEE-1VA101XP  value 100uF  [EEE-1VA101XP]
C17  100nF  [C0603]
C18  100nF  [C0603]
D5  SMAJ30A  [SMA-SM]
D6  SMAJ30A  [SMA-SM]
D7  SMAJ30A  [SMA-SM]
D8  SMAJ30A  [SMA-SM]
J9  Molex 0705430003  [4POL254]  (parts A,B,C,D of 4)
R24  10K  [R0402]
R25  10K  [R0402]
R26  100K  [R0402]
R27  1M  [R0402]
R28  2512  value 0.10  [2512R-0.55]
R29  2512  value 0.10  [2512R-0.55]
R30  NP  [R0402]
R31  NP  [R0402]
TP13  TP4  [TP-2]  (value not drawn)
TP14  TP4  [TP-2]  (value not drawn)
TP15  TP4  [TP-2]  (value not drawn)
TP16  TP4  [TP-2]  (value not drawn)
TP17  TP4  [TP-2]  (value not drawn)
TP18  TP4  [TP-2]  (value not drawn)
TP19  TP4  [TP-2]  (value not drawn)
TP20  TP4  [TP-2]  (value not drawn)
TP21  TP4  [TP-2]  (value not drawn)
TP22  TP4  [TP-2]  (value not drawn)
TP23  TP4  [TP-2]  (value not drawn)
TP24  TP4  [TP-2]  (value not drawn)
U3  DRV8825  [DRV8825PWPR]

### Ports
DIR, EN, MODE0, MODE1, MODE2, REF, STEP

### Nets
3.3VCC: R30.2 U3.16(nReset) U3.17(nSleep)
+12VCC1: C9.2 C16.1 C17.1 C18.1 R27.2 U3.4(VMA) U3.11(VMB)
GND: C7.1 C8.1 C11.1 C12.2 C13.2 C14.2 C15.1 C16.2 C17.2 C18.2 D5.C D6.C D7.C D8.C R26.1 R28.1 R29.1 R31.1 U3.14(GND) U3.28(GND) U3.29(GND)
DECAY: R30.1 R31.2 U3.19(DECAY)
DIR: TP23.1 U3.20(DIR) ; port DIR
EN: TP15.1 U3.21(nENBL) ; port EN
MODE0: TP22.1 U3.24(MODE0) ; port MODE0
MODE1: TP21.1 U3.25(MODE1) ; port MODE1
MODE2: TP20.1 U3.26(MODE2) ; port MODE2
REF: R24.1 ; port REF
STEP: TP24.1 U3.22(STEP) ; port STEP
NetC7_2: C7.2 R25.2 R26.2 TP13.1 TP14.1 U3.12(AVREF) U3.13(BVREF)
NetC8_2: C8.2 R24.2 R25.1
NetC9_1: C9.1 R27.1 U3.3(VCP)
NetC10_1: C10.1 U3.1(CP1)
NetC10_2: C10.2 U3.2(CP2)
NetC11_2: C11.2 U3.15(V3P3OUT)
NetC12_1: C12.1 D5.A J9.4(OUT1B) TP16.1 U3.5(AOUT1)
NetC13_1: C13.1 D6.A J9.3(OUT1A) TP17.1 U3.7(AOUT2)
NetC14_1: C14.1 D7.A J9.1(OUT2B) TP18.1 U3.10(BOUT1)
NetC15_2: C15.2 D8.A J9.2(OUT2A) TP19.1 U3.8(BOUT2)
NetR28_2: R28.2 U3.9(ISENB)
NetR29_2: R29.2 U3.6(ISENA)

Not connected (* = marked no-connect by the designer): U3 18(nFault)* 23(NC) 27(nHome)*

### Channels
M1: designators end in A; ports DIR=DIR1 EN=EN1 MODE0=MOD0E1 MODE1=MOD1E1 MODE2=MOD2E1 REF=REF1 STEP=STEP1
M2: designators end in B; ports DIR=DIR2 EN=EN2 MODE0=MOD0E2 MODE1=MOD1E2 MODE2=MOD2E2 REF=REF2 STEP=STEP2
M3: designators end in C; ports DIR=DIR3 EN=EN3 MODE0=MOD0E3 MODE1=MOD1E3 MODE2=MOD2E3 REF=REF3 STEP=STEP3
M4: designators end in D; ports DIR=DIR4 EN=EN4 MODE0=MOD0E4 MODE1=MOD1E4 MODE2=MOD2E4 REF=REF4 STEP=STEP4

### Notes on the sheet
- NOTE: VMA/VMB Dcoupling
- Can be off

### Library data of the parts
C7 C8 = GRM155R71H103JA88D: CAP CER 10000PF 50V X7R 0402; MFR: Murata; Tolerance: 10%; Voltage: 6.3VDC; Published: 10 - Dec - 2014; LatestRevisionDate: 10 - Dec - 2014; LatestRevisionNote: Ultimachine Footprint Added; Publisher: Ultimachine; Component Type: Chip Capacitor; MFR Part #: GRM155R71H103JA88D; Part Description: CAP CER 10000PF 50V X7R 0402; Mounting Type: SMT 0402; Datasheet: http://search.murata.co.jp/Ceramy/image/img/A01X/G101/ENG/GRM155R71H103JA88-01.pdf; Height: 0.5 ±0.05mm; Digikey #: 490-7763-1-ND; PackageReference: 0402
C9 = GRM155R71C104KA88D: as C68 on sheet ATSAM3X8E Main Controller - TR R1.1; Published: 23-Apr-2014; Publisher: UltiMachine; LastRevisionDate: 23-Apr-2014; ManufacturerPartNumber: GRM155R71C104KA88D; VALUE: 100nF
C10 = GRM155R71H103JA88D: as C5 on sheet ES; Published: 10 - Dec - 2014; LatestRevisionDate: 10 - Dec - 2014; LatestRevisionNote: Ultimachine Footprint Added; Publisher: Ultimachine; Component Type: Chip Capacitor; MFR Part #: GRM155R71H103JA88D; Mounting Type: SMT 0402; Datasheet: http://search.murata.co.jp/Ceramy/image/img/A01X/G101/ENG/GRM155R71H103JA88-01.pdf; Height: 0.5 ±0.05mm; Digikey #: 490-7763-1-ND; PackageReference: 0402
C11 = GRM155R60J474KE19D: 0.47uF 6.3v C0402 - GRM155R60J474KE19D; MFR: Murata; Part Description: CAP CER 0.47UF 6.3V 10% X5R 0402; Tolerance: 10%; Voltage: 6.3VDC; Published: 10 - Dec - 2014; LatestRevisionDate: 10 - Dec - 2014; LatestRevisionNote: Ultimachine Footprint Added; Publisher: Ultimachine; Component Type: Chip Capacitor; MFR Part #: GRM155R60J474KE19D; Mounting Type: SMT 0402; Datasheet: http://search.murata.co.jp/Ceramy/image/img/A01X/G101/ENG/GRM155R60J474KE19-01.pdf; Height: 0.5 ±0.05mm; PackageReference: 0402
C12-C15 = C0603C102K5RACTU: as C14 on sheet Power; Published: 23-Apr-2014; Publisher: UltiMachine; LastRevisionDate: 23-Apr-2014; ManufacturerPartNumber: C0603C102K5RACTU; VALUE: 1nF
C16 = EEE-1VA101XP: as C1 on sheet Power; Digikey Part #: PCE3951CT-ND; Price: $0.63; Mount Type: SMT Panasonic VS D Series; Status: Active; Height: 7.70mm; Datasheet: http://industrial.panasonic.com/www-cgi/jvcr13pz.cgi?E+PZ+3+ABA0002+EEE1VA101XP+7+WW; Manufacture Part #: EEE-1VA101XP
C17 C18 = C0603C104K5RACTU: as C4 on sheet Power; Published: 23-Apr-2014; Publisher: UltiMachine; LastRevisionDate: 23-Apr-2014; ManufacturerPartNumber: C0603C104K5RACTU; VALUE: 100nF
D5-D8 = SMAJ30A: DIODE TVS 30V SMA; LastRevisionNote: ImportComponents; Published: 23-Apr-2014; Publisher: UltiMachine; LastRevisionDate: 23-Apr-2014; ManufacturerPartNumber: SMAJ30A
J9 = Molex 0705430003 Alt: Molex 4 Pin Clip Connector
R24 R25 = RC0402FR-0710KP: as R54 on sheet ATSAM3X8E Main Controller - TR R1.1; Published: 23-Apr-2014; Publisher: UltiMachine; LastRevisionDate: 23-Apr-2014; ManufacturerPartNumber: RC0402FR-0710KP; VALUE: 10K
R26 = RC1005F104CS: as R35 on sheet ATSAM3X8E Main Controller - TR R1.1; Published: 23-Apr-2014; Publisher: UltiMachine; LastRevisionDate: 23-Apr-2014; ManufacturerPartNumber: RC1005F104CS; VALUE: 100K
R27 = ERJ2GEJ105X: RES 0402 1M 100mW 5%; LastRevisionNote: ImportComponents; Published: 23-Apr-2014; Publisher: UltiMachine; LastRevisionDate: 23-Apr-2014; ManufacturerPartNumber: ERJ2GEJ105X; VALUE: 1M
R28 R29 = CSRN2512FTR100: RES SMD 0.1 OHM 1% 2W 2512; MFR: Stackpole ELectronics Inc; PackageReference: 2512; MFR #: CSRN2512FTR100; Digikey #: CSRN2512FTR100TR-ND; PDF: http://www.seielect.com/catalog/SEI-CSR_CSRN.pdf
R30 R31 = Resistor: LastRevisionNote: ImportComponents; Published: 23-Apr-2014; Publisher: UltiMachine; LastRevisionDate: 23-Apr-2014; VALUE: NP
TP13-TP24 = Socket: LatestRevisionDate: 17-Jul-2002; LatestRevisionNote: Re-released for DXP Platform.; Publisher: Altium Limited
U3 = DRV8825: DRV8825 Ti Stepper Driver; Manufacture: Texas Instruments; Mountining Type: SMD - Ti PowerPAD Package; Voltage: 8.2-45VDC; Cost (1000 qty): 2.25; Part Number: DRV8825PWPR; Status: In-Production; Pins: 28 Pins and one Exposed Pad; Datasheet: http://www.ti.com/lit/gpn/drv8825; Height: 1.2mm; Tolerance: N/A; Type: Stepper Driver - Integrated Circuit; Lead Free: YES

## Sheet MOSFETs and Driver.SchDoc
size Letter; DocumentNumber: 5; SheetNumber: 5; SheetTotal: 8
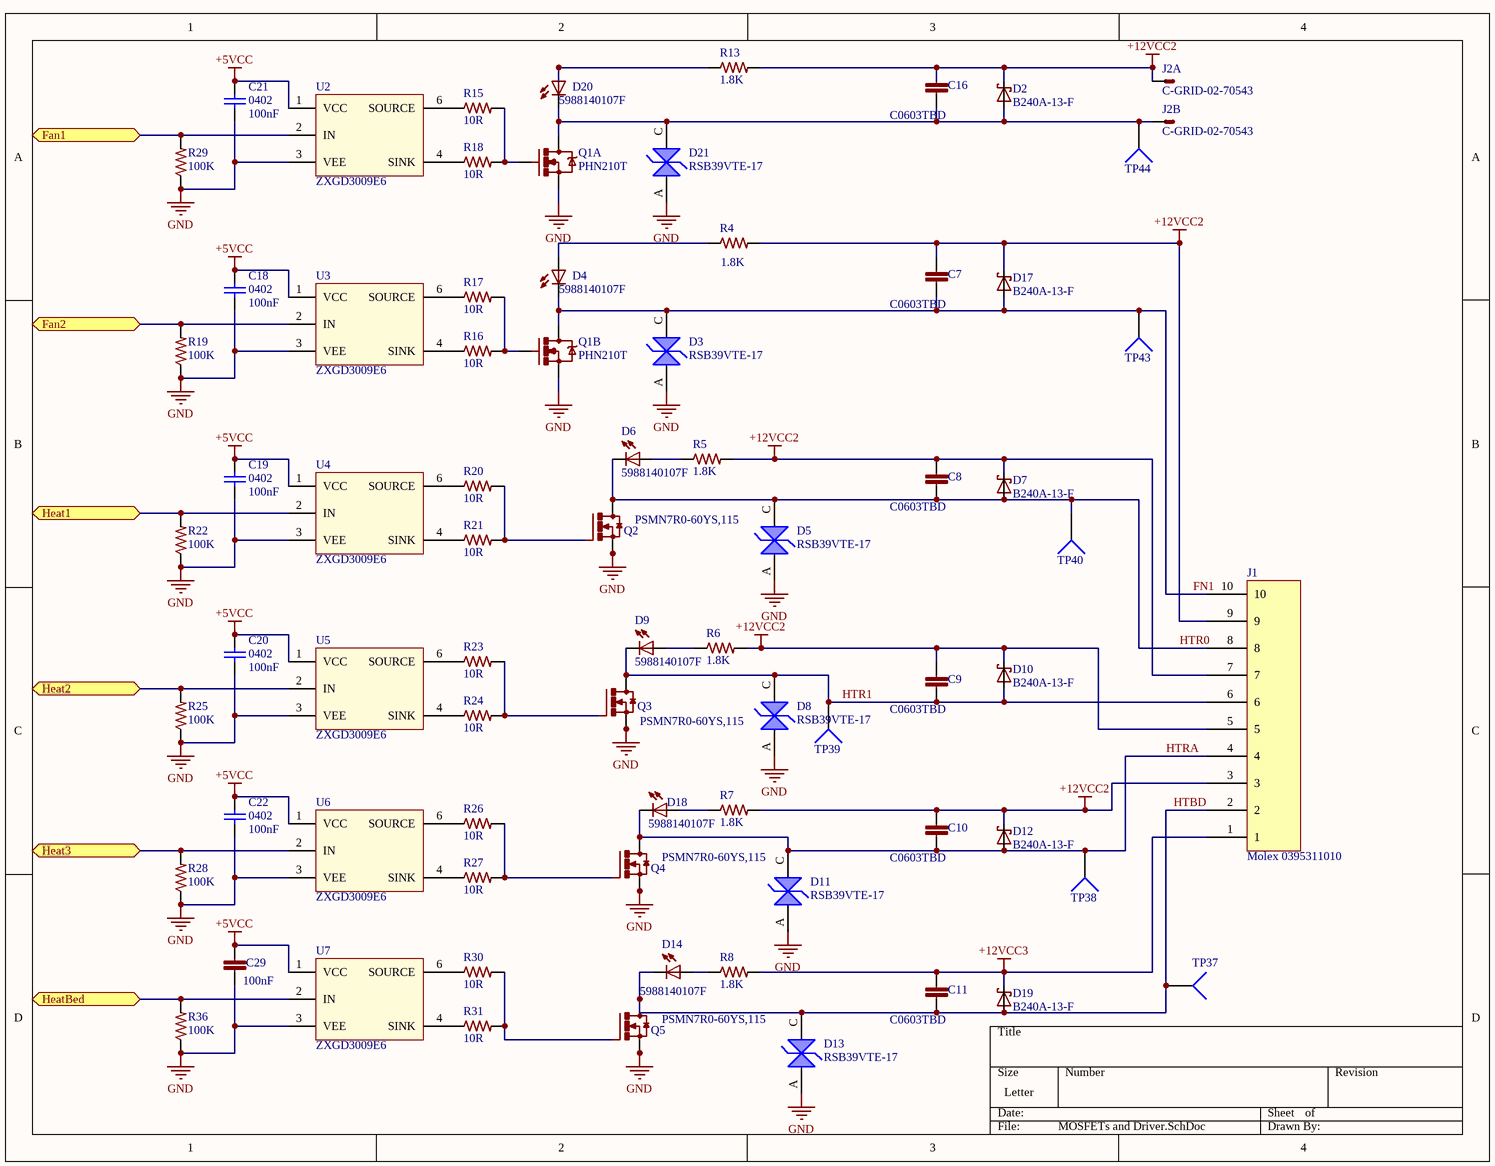
[diagram p5: MOSFETs and Driver.SchDoc]

### Parts
C7  C0603TBD  [C0603]
C8  C0603TBD  [C0603]
C9  C0603TBD  [C0603]
C10  C0603TBD  [C0603]
C11  C0603TBD  [C0603]
C16  C0603TBD  [C0603]
C18  value 100nF  [C0402]  (hidden comment: 0402)
C19  value 100nF  [C0402]  (hidden comment: 0402)
C20  value 100nF  [C0402]  (hidden comment: 0402)
C21  value 100nF  [C0402]  (hidden comment: 0402)
C22  value 100nF  [C0402]  (hidden comment: 0402)
C29  100nF  [C0402]
D2  B240A-13-F  [SMA-SM]
D3  RSB39VTE-17  [SOD323-R]
D4  5988140107F  [LED2012120]
D5  RSB39VTE-17  [SOD323-R]
D6  5988140107F  [LED2012120]
D7  B240A-13-F  [SMA-SM]
D8  RSB39VTE-17  [SOD323-R]
D9  5988140107F  [LED2012120]
D10  B240A-13-F  [SMA-SM]
D11  RSB39VTE-17  [SOD323-R]
D12  B240A-13-F  [SMA-SM]
D13  RSB39VTE-17  [SOD323-R]
D14  5988140107F  [LED2012120]
D17  B240A-13-F  [SMA-SM]
D18  5988140107F  [LED2012120]
D19  B240A-13-F  [SMA-SM]
D20  5988140107F  [LED2012120]
D21  RSB39VTE-17  [SOD323-R]
J1  Molex 0395311010  [MSTBV10]
J2  C-GRID-02-70543  [70543-02]  (parts A,B of 2)
Q1  PHN210T  [SOIC8-dual-drain]  (parts A,B of 2)
Q2  PSMN7R0-60YS,115  [SOT669]
Q3  PSMN7R0-60YS,115  [SOT669]
Q4  PSMN7R0-60YS,115  [SOT669]
Q5  PSMN7R0-60YS,115  [SOT669]
R4  1.8K  [R0603]
R5  1.8K  [R0603]
R6  1.8K  [R0603]
R7  1.8K  [R0603]
R8  1.8K  [R0603]
R13  1.8K  [R0603]
R15  10R  [R0402]
R16  10R  [R0402]
R17  10R  [R0402]
R18  10R  [R0402]
R19  100K  [R0402]
R20  10R  [R0402]
R21  10R  [R0402]
R22  100K  [R0402]
R23  10R  [R0402]
R24  10R  [R0402]
R25  100K  [R0402]
R26  10R  [R0402]
R27  10R  [R0402]
R28  100K  [R0402]
R29  100K  [R0402]
R30  10R  [R0402]
R31  10R  [R0402]
R36  100K  [R0402]
TP37  TP4  [TP-2]  (value not drawn)
TP38  TP4  [TP-2]  (value not drawn)
TP39  TP4  [TP-2]  (value not drawn)
TP40  TP4  [TP-2]  (value not drawn)
TP43  TP4  [TP-2]  (value not drawn)
TP44  TP4  [TP-2]  (value not drawn)
U2  ZXGD3009E6  [SOT26P285X140-6L]
U3  ZXGD3009E6  [SOT26P285X140-6L]
U4  ZXGD3009E6  [SOT26P285X140-6L]
U5  ZXGD3009E6  [SOT26P285X140-6L]
U6  ZXGD3009E6  [SOT26P285X140-6L]
U7  ZXGD3009E6  [SOT26P285X140-6L]

### Ports
Fan1, Fan2, Heat1, Heat2, Heat3, HeatBed

### Nets
+5VCC: C18.2 C19.2 C20.2 C21.2 C22.2 C29.1 U2.1(VCC) U3.1(VCC) U4.1(VCC) U5.1(VCC) U6.1(VCC) U7.1(VCC)
+12VCC2: C7.1 C8.1 C9.1 C10.1 C16.1 D2.C D7.C D10.C D12.C D17.C J1.3 J1.5 J1.7 J1.9 J2.1(S) R4.2 R5.2 R6.2 R7.2 R13.2
+12VCC3: C11.1 D19.C J1.1 R8.2
GND: C18.1 C19.1 C20.1 C21.1 C22.1 C29.2 D3.A D5.A D8.A D11.A D13.A D21.A Q1.1(S) Q1.3(S) Q2.1(S) Q2.2(S) Q2.3(S) Q3.1(S) Q3.2(S) Q3.3(S) Q4.1(S) Q4.2(S) Q4.3(S) Q5.1(S) Q5.2(S) Q5.3(S) R19.1 R22.1 R25.1 R28.1 R29.1 R36.1 U2.3(VEE) U3.3(VEE) U4.3(VEE) U5.3(VEE) U6.3(VEE) U7.3(VEE)
BED_PWM: R36.2 U7.2(IN) ; port HeatBed
FET_PWM1: R29.2 U2.2(IN) ; port Fan1
FET_PWM2: R19.2 U3.2(IN) ; port Fan2
FET_PWM3: R22.2 U4.2(IN) ; port Heat1
FET_PWM4: R25.2 U5.2(IN) ; port Heat2
FET_PWM5: R28.2 U6.2(IN) ; port Heat3
FN1: C7.2 D3.C D4.C D17.A J1.10 Q1.5(D) TP43.1
HTBD: C11.2 D13.C D14.C D19.A J1.2 Q5.MB(D) TP37.1
HTR0: C8.2 D5.C D6.C D7.A J1.8 Q2.MB(D) TP40.1
HTR1: C9.2 D8.C D9.C D10.A J1.6 Q3.MB(D) TP39.1
HTRA: C10.2 D11.C D12.A D18.C J1.4 Q4.MB(D) TP38.1
NetC16_2: C16.2 D2.A D20.C D21.C J2.2(S) Q1.7(D) TP44.1
NetD4_A: D4.A R4.1
NetD6_A: D6.A R5.1
NetD9_A: D9.A R6.1
NetD14_A: D14.A R8.1
NetD18_A: D18.A R7.1
NetD20_A: D20.A R13.1
NetQ1_2: Q1.2(G) R15.2 R18.2
NetQ1_4: Q1.4(G) R16.2 R17.2
NetQ2_4: Q2.4(G) R20.2 R21.2
NetQ3_4: Q3.4(G) R23.2 R24.2
NetQ4_4: Q4.4(G) R26.2 R27.2
NetQ5_4: Q5.4(G) R30.2 R31.2
NetR15_1: R15.1 U2.6(SOURCE)
NetR16_1: R16.1 U3.4(SINK)
NetR17_1: R17.1 U3.6(SOURCE)
NetR18_1: R18.1 U2.4(SINK)
NetR20_1: R20.1 U4.6(SOURCE)
NetR21_1: R21.1 U4.4(SINK)
NetR23_1: R23.1 U5.6(SOURCE)
NetR24_1: R24.1 U5.4(SINK)
NetR26_1: R26.1 U6.6(SOURCE)
NetR27_1: R27.1 U6.4(SINK)
NetR30_1: R30.1 U7.6(SOURCE)
NetR31_1: R31.1 U7.4(SINK)

### Library data of the parts
C7-C11 C16 = C0603TBD: Capacitor Non Polarized; LastRevisionNote: ImportComponents; Published: 23-Apr-2014; Publisher: UltiMachine; LastRevisionDate: 23-Apr-2014; VALUE: C0603TBD
C18-C22 = GRM155R71C104KA88D: CAP CER 0.1UF (100nF) 16V 10% X7R 0402; MFR: Murata; Part Description: CAP CER 0.1UF 16V 10% X7R 0402; Published: 10 - Dec - 2014; LatestRevisionDate: 10 - Dec - 2014; LatestRevisionNote: Ultimachine Footprint Added; Publisher: Ultimachine; Component Type: Chip Capacitor; MFR Part #: GRM155R71C104KA88D; Mounting Type: SMT 0402; Datasheet: http://psearch.murata.com/capacitor/product/GRM155R71C104KA88%23.pdf; Height: 0.5 ±0.05mm; Tolerance: 10%; Voltage: 16v; PackageReference: 0402
C29 = GRM155R71C104KA88D: as C68 on sheet ATSAM3X8E Main Controller - TR R1.1; Published: 23-Apr-2014; Publisher: UltiMachine; LastRevisionDate: 23-Apr-2014; ManufacturerPartNumber: GRM155R71C104KA88D; VALUE: 100nF
D2 D7 D10 D12 D17 D19 = SK310A: as D15 on sheet Power; Published: 23-Apr-2014; Publisher: UltiMachine; LastRevisionDate: 23-Apr-2014; ManufacturerPartNumber: SK310A
D3 D5 D8 D11 D13 D21 = RSB39VTE-17: DIODE TVS
D4 D6 D9 D14 D18 D20 = 5988140107F: as D25 on sheet ATSAM3X8E Main Controller - TR R1.1; Published: 23-Apr-2014; Publisher: UltiMachine; LastRevisionDate: 23-Apr-2014; VALUE: 5988140107F
J1 = 0395311010 - Molex 10 Position Connector: MSBTV10 10 port connector same as RAMBo; Manufacture: Molex; Mounting Type: Through Hole; Part Number: 0395311010; Datasheet: http://www.molex.com/pdm_docs/sd/395311002_sd.pdf; Status: Active; Pin Count: 10 , 5.08mm pitch; Height: *; Lead Free: YES; Cost: 2.46000
J2 = C-GRID-02-70543: as J5 on sheet TR; Published: 23-Apr-2014; Publisher: UltiMachine; LastRevisionDate: 23-Apr-2014
Q1 = PHN210T: Dual N-channel TrenchMOS intermediate level FET
Q2-Q5 = PSMN7R0-60YS,115: Mosfet N-channel 60V 356A 117W 9.3mOhms; LastRevisionNote: ImportComponents; Published: 23-Apr-2014; Publisher: UltiMachine; LastRevisionDate: 23-Apr-2014; ManufacturerPartNumber: PSMN7R0-60YS,115
R4-R8 R13 = RC0603JR-071K8L: RES 0603 1.8K 100mW 5%; LastRevisionNote: ImportComponents; Published: 23-Apr-2014; Publisher: UltiMachine; LastRevisionDate: 23-Apr-2014; ManufacturerPartNumber: RC0603JR-071K8L; VALUE: 1.8K
R15-R18 R20 R21 R23 R24 R26 R27 R30 R31 = RC0402FR-0710RL: RES SMD 10K OHM 1% 1/16W 0402; ManufacturerPartNumber: RC0402FR-0710KP; LastRevisionNote: ImportComponents; Published: 23-Apr-2014; Publisher: UltiMachine; LastRevisionDate: 23-Apr-2014; VALUE: 10R
R19 R22 R25 R28 R29 R36 = RC1005F104CS: as R35 on sheet ATSAM3X8E Main Controller - TR R1.1; Published: 23-Apr-2014; Publisher: UltiMachine; LastRevisionDate: 23-Apr-2014; ManufacturerPartNumber: RC1005F104CS; VALUE: 100K
TP37-TP40 TP43 TP44 = Socket: LatestRevisionDate: 17-Jul-2002; LatestRevisionNote: Re-released for DXP Platform.; Publisher: Altium Limited
U2-U7 = ZXGD3009E6: MOSFET DRVR 3A 1-OUT High Speed Non-Inv6-Pin SOT-26 T/R

## Sheet MZ.SchDoc
size Letter; DocumentNumber: 4; SheetNumber: 4; SheetTotal: 8
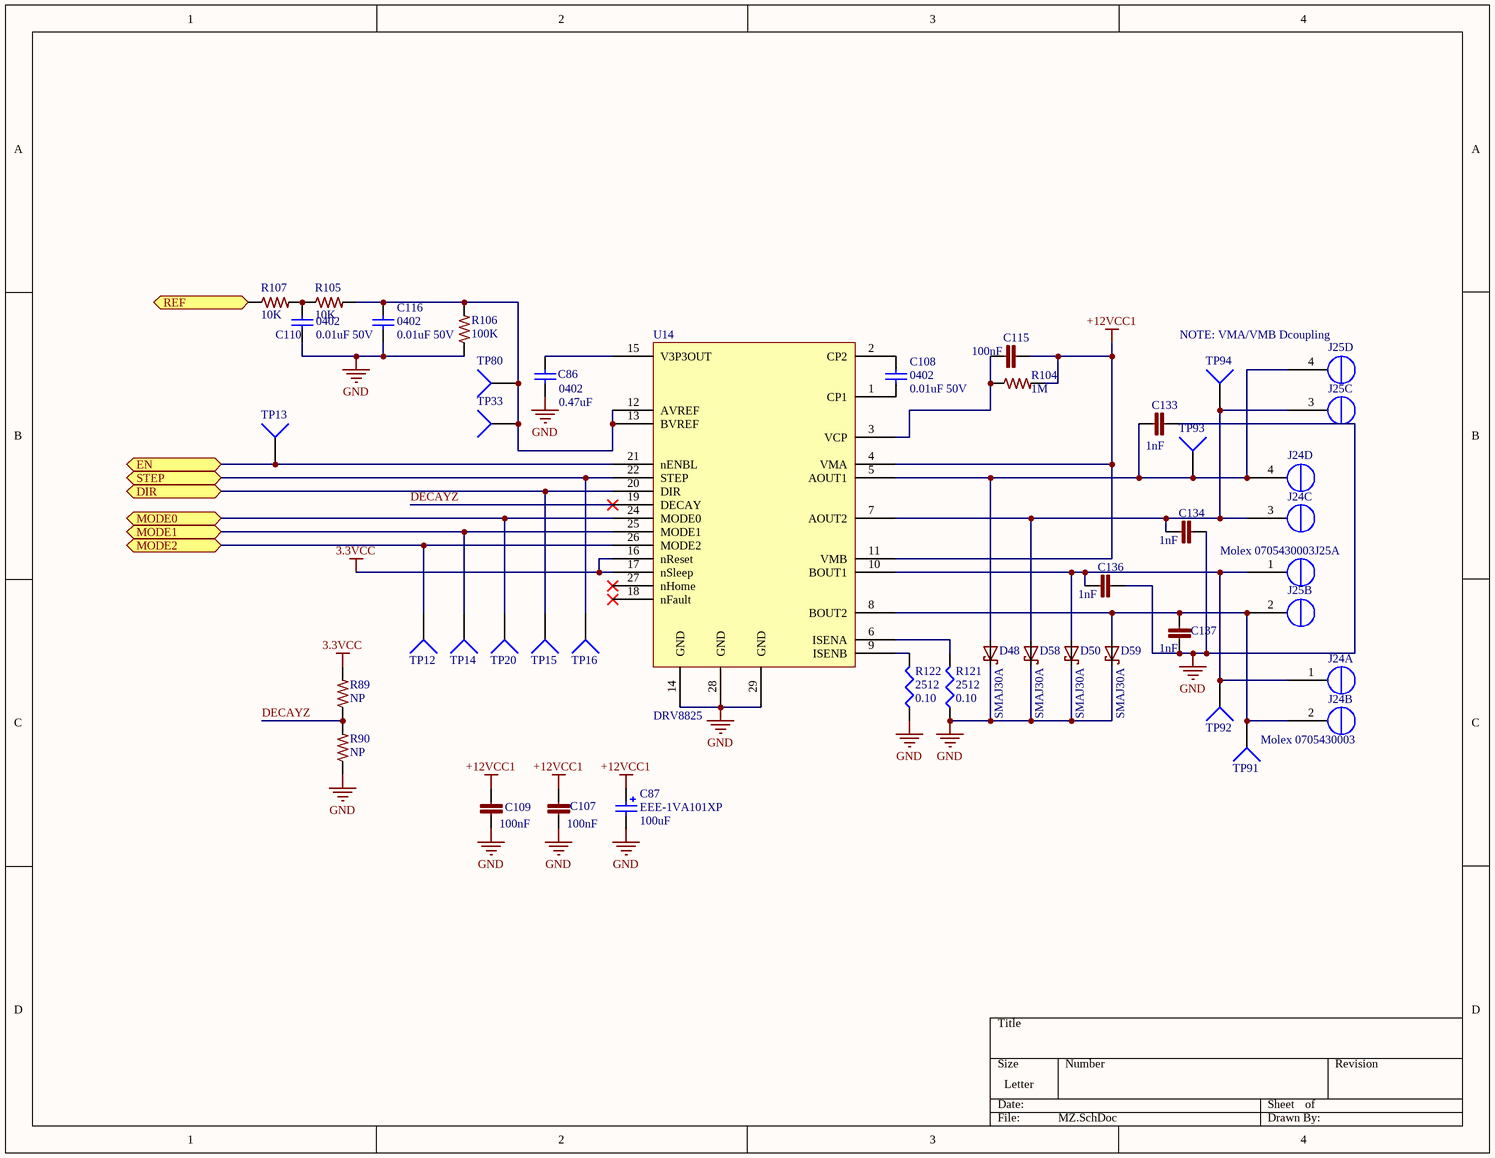
[diagram p6: MZ.SchDoc]

### Parts
C86  value 0.47uF  [C0402]  (hidden comment: 0402)
C87  EEE-1VA101XP  value 100uF  [EEE-1VA101XP]
C107  100nF  [C0603]
C108  value 0.01uF 50V  [C0402]  (hidden comment: 0402)
C109  100nF  [C0603]
C110  value 0.01uF 50V  [C0402]  (hidden comment: 0402)
C115  100nF  [C0402]
C116  value 0.01uF 50V  [C0402]  (hidden comment: 0402)
C133  1nF  [C0603]
C134  1nF  [C0603]
C136  1nF  [C0603]
C137  1nF  [C0603]
D48  SMAJ30A  [SMA-SM]
D50  SMAJ30A  [SMA-SM]
D58  SMAJ30A  [SMA-SM]
D59  SMAJ30A  [SMA-SM]
J24  Molex 0705430003  [4POL254]  (parts A,B,C,D of 4)
J25  Molex 0705430003  [4POL254]  (parts A,B,C,D of 4)
R89  NP  [R0402]
R90  NP  [R0402]
R104  1M  [R0402]
R105  10K  [R0402]
R106  100K  [R0402]
R107  10K  [R0402]
R121  2512  value 0.10  [2512R-0.55]
R122  2512  value 0.10  [2512R-0.55]
TP12  TP4  [TP-2]  (value not drawn)
TP13  TP4  [TP-2]  (value not drawn)
TP14  TP4  [TP-2]  (value not drawn)
TP15  TP4  [TP-2]  (value not drawn)
TP16  TP4  [TP-2]  (value not drawn)
TP20  TP4  [TP-2]  (value not drawn)
TP33  TP4  [TP-2]  (value not drawn)
TP80  TP4  [TP-2]  (value not drawn)
TP91  TP4  [TP-2]  (value not drawn)
TP92  TP4  [TP-2]  (value not drawn)
TP93  TP4  [TP-2]  (value not drawn)
TP94  TP4  [TP-2]  (value not drawn)
U14  DRV8825  [DRV8825PWPR]

### Ports
DIR, EN, MODE0, MODE1, MODE2, REF, STEP

### Nets
3.3VCC: R89.2 U14.16(nReset) U14.17(nSleep)
+12VCC1: C87.1 C107.1 C109.1 C115.2 R104.2 U14.4(VMA) U14.11(VMB)
GND: C86.1 C87.2 C107.2 C109.2 C110.1 C116.1 C133.2 C134.2 C136.2 C137.1 D48.C D50.C D58.C D59.C R90.1 R106.1 R121.1 R122.1 U14.14(GND) U14.28(GND) U14.29(GND)
DECAYZ: R89.1 R90.2 U14.19(DECAY)
DIR_Z: TP15.1 U14.20(DIR) ; port DIR
EN_Z: TP13.1 U14.21(nENBL) ; port EN
MOD0E_Z: TP20.1 U14.24(MODE0) ; port MODE0
MOD1E_Z: TP14.1 U14.25(MODE1) ; port MODE1
MOD2E_Z: TP12.1 U14.26(MODE2) ; port MODE2
REF_Z: R107.1 ; port REF
STEP_Z: TP16.1 U14.22(STEP) ; port STEP
NetC86_2: C86.2 U14.15(V3P3OUT)
NetC108_1: C108.1 U14.1(CP1)
NetC108_2: C108.2 U14.2(CP2)
NetC110_2: C110.2 R105.1 R107.2
NetC115_1: C115.1 R104.1 U14.3(VCP)
NetC116_2: C116.2 R105.2 R106.2 TP33.1 TP80.1 U14.12(AVREF) U14.13(BVREF)
NetC133_1: C133.1 D48.A J24.4(OUT1B) J25.4(OUT1B) TP93.1 U14.5(AOUT1)
NetC134_1: C134.1 D58.A J24.3(OUT1A) J25.3(OUT1A) TP94.1 U14.7(AOUT2)
NetC136_1: C136.1 D50.A J24.1(OUT2B) J25.1(OUT2B) TP92.1 U14.10(BOUT1)
NetC137_2: C137.2 D59.A J24.2(OUT2A) J25.2(OUT2A) TP91.1 U14.8(BOUT2)
NetR121_2: R121.2 U14.6(ISENA)
NetR122_2: R122.2 U14.9(ISENB)

Not connected (* = marked no-connect by the designer): U14 18(nFault)* 23(NC) 27(nHome)*

### Notes on the sheet
- NOTE: VMA/VMB Dcoupling

### Library data of the parts
C86 = GRM155R60J474KE19D: as C11 on sheet M; Published: 10 - Dec - 2014; LatestRevisionDate: 10 - Dec - 2014; LatestRevisionNote: Ultimachine Footprint Added; Publisher: Ultimachine; Component Type: Chip Capacitor; MFR Part #: GRM155R60J474KE19D; Mounting Type: SMT 0402; Datasheet: http://search.murata.co.jp/Ceramy/image/img/A01X/G101/ENG/GRM155R60J474KE19-01.pdf; Height: 0.5 ±0.05mm; PackageReference: 0402
C87 = EEE-1VA101XP: as C1 on sheet Power; Digikey Part #: PCE3951CT-ND; Price: $0.63; Mount Type: SMT Panasonic VS D Series; Status: Active; Height: 7.70mm; Datasheet: http://industrial.panasonic.com/www-cgi/jvcr13pz.cgi?E+PZ+3+ABA0002+EEE1VA101XP+7+WW; Manufacture Part #: EEE-1VA101XP
C107 C109 = C0603C104K5RACTU: as C4 on sheet Power; Published: 23-Apr-2014; Publisher: UltiMachine; LastRevisionDate: 23-Apr-2014; ManufacturerPartNumber: C0603C104K5RACTU; VALUE: 100nF
C108 C110 C116 = GRM155R71H103JA88D: as C7 on sheet M; Published: 10 - Dec - 2014; LatestRevisionDate: 10 - Dec - 2014; LatestRevisionNote: Ultimachine Footprint Added; Publisher: Ultimachine; Component Type: Chip Capacitor; MFR Part #: GRM155R71H103JA88D; Part Description: CAP CER 10000PF 50V X7R 0402; Mounting Type: SMT 0402; Datasheet: http://search.murata.co.jp/Ceramy/image/img/A01X/G101/ENG/GRM155R71H103JA88-01.pdf; Height: 0.5 ±0.05mm; Digikey #: 490-7763-1-ND; PackageReference: 0402
C115 = GRM155R71C104KA88D: as C68 on sheet ATSAM3X8E Main Controller - TR R1.1; Published: 23-Apr-2014; Publisher: UltiMachine; LastRevisionDate: 23-Apr-2014; ManufacturerPartNumber: GRM155R71C104KA88D; VALUE: 100nF
C133 C134 C136 C137 = C0603C102K5RACTU: as C14 on sheet Power; Published: 23-Apr-2014; Publisher: UltiMachine; LastRevisionDate: 23-Apr-2014; ManufacturerPartNumber: C0603C102K5RACTU; VALUE: 1nF
D48 D50 D58 D59 = SMAJ30A: as D5 on sheet M; Published: 23-Apr-2014; Publisher: UltiMachine; LastRevisionDate: 23-Apr-2014; ManufacturerPartNumber: SMAJ30A
J24 J25 = Molex 0705430003 Alt: Molex 4 Pin Clip Connector
R89 R90 = Resistor: LastRevisionNote: ImportComponents; Published: 23-Apr-2014; Publisher: UltiMachine; LastRevisionDate: 23-Apr-2014; VALUE: NP
R104 = ERJ2GEJ105X: as R27 on sheet M; Published: 23-Apr-2014; Publisher: UltiMachine; LastRevisionDate: 23-Apr-2014; ManufacturerPartNumber: ERJ2GEJ105X; VALUE: 1M
R105 R107 = RC0402FR-0710KP: as R54 on sheet ATSAM3X8E Main Controller - TR R1.1; Published: 23-Apr-2014; Publisher: UltiMachine; LastRevisionDate: 23-Apr-2014; ManufacturerPartNumber: RC0402FR-0710KP; VALUE: 10K
R106 = RC1005F104CS: as R35 on sheet ATSAM3X8E Main Controller - TR R1.1; Published: 23-Apr-2014; Publisher: UltiMachine; LastRevisionDate: 23-Apr-2014; ManufacturerPartNumber: RC1005F104CS; VALUE: 100K
R121 R122 = CSRN2512FTR100: as R28 on sheet M; PackageReference: 2512; MFR #: CSRN2512FTR100; Digikey #: CSRN2512FTR100TR-ND; PDF: http://www.seielect.com/catalog/SEI-CSR_CSRN.pdf
TP12-TP16 TP20 TP33 TP80 TP91-TP94 = Socket: LatestRevisionDate: 17-Jul-2002; LatestRevisionNote: Re-released for DXP Platform.; Publisher: Altium Limited
U14 = DRV8825: as U3 on sheet M; Part Number: DRV8825PWPR; Status: In-Production; Pins: 28 Pins and one Exposed Pad; Datasheet: http://www.ti.com/lit/gpn/drv8825; Height: 1.2mm; Tolerance: N/A; Type: Stepper Driver - Integrated Circuit; Lead Free: YES